# EAGLE schematic FLYTE 3.01 (EAGLE 9.6.2)
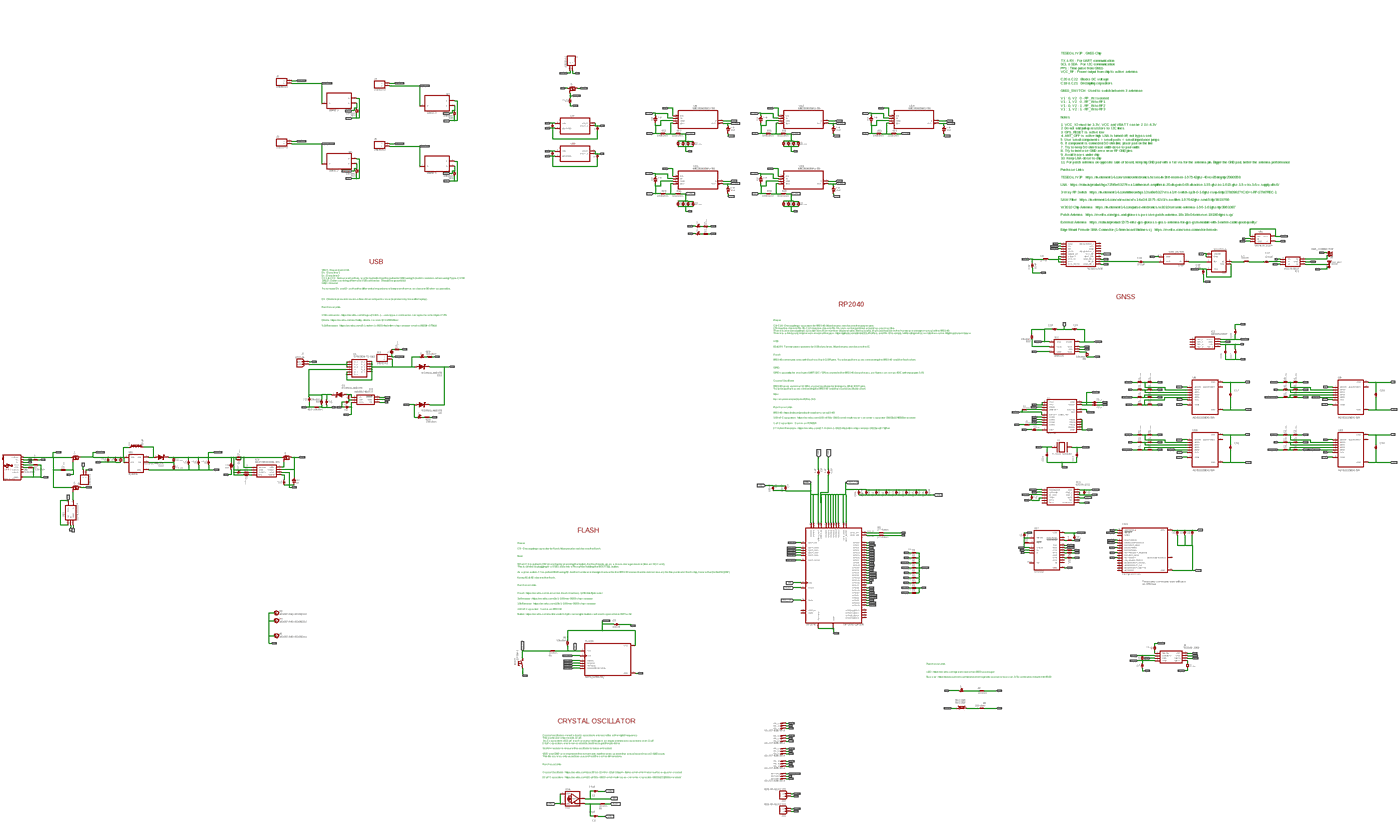
[diagram p0: schematic, sheet 1, overview]
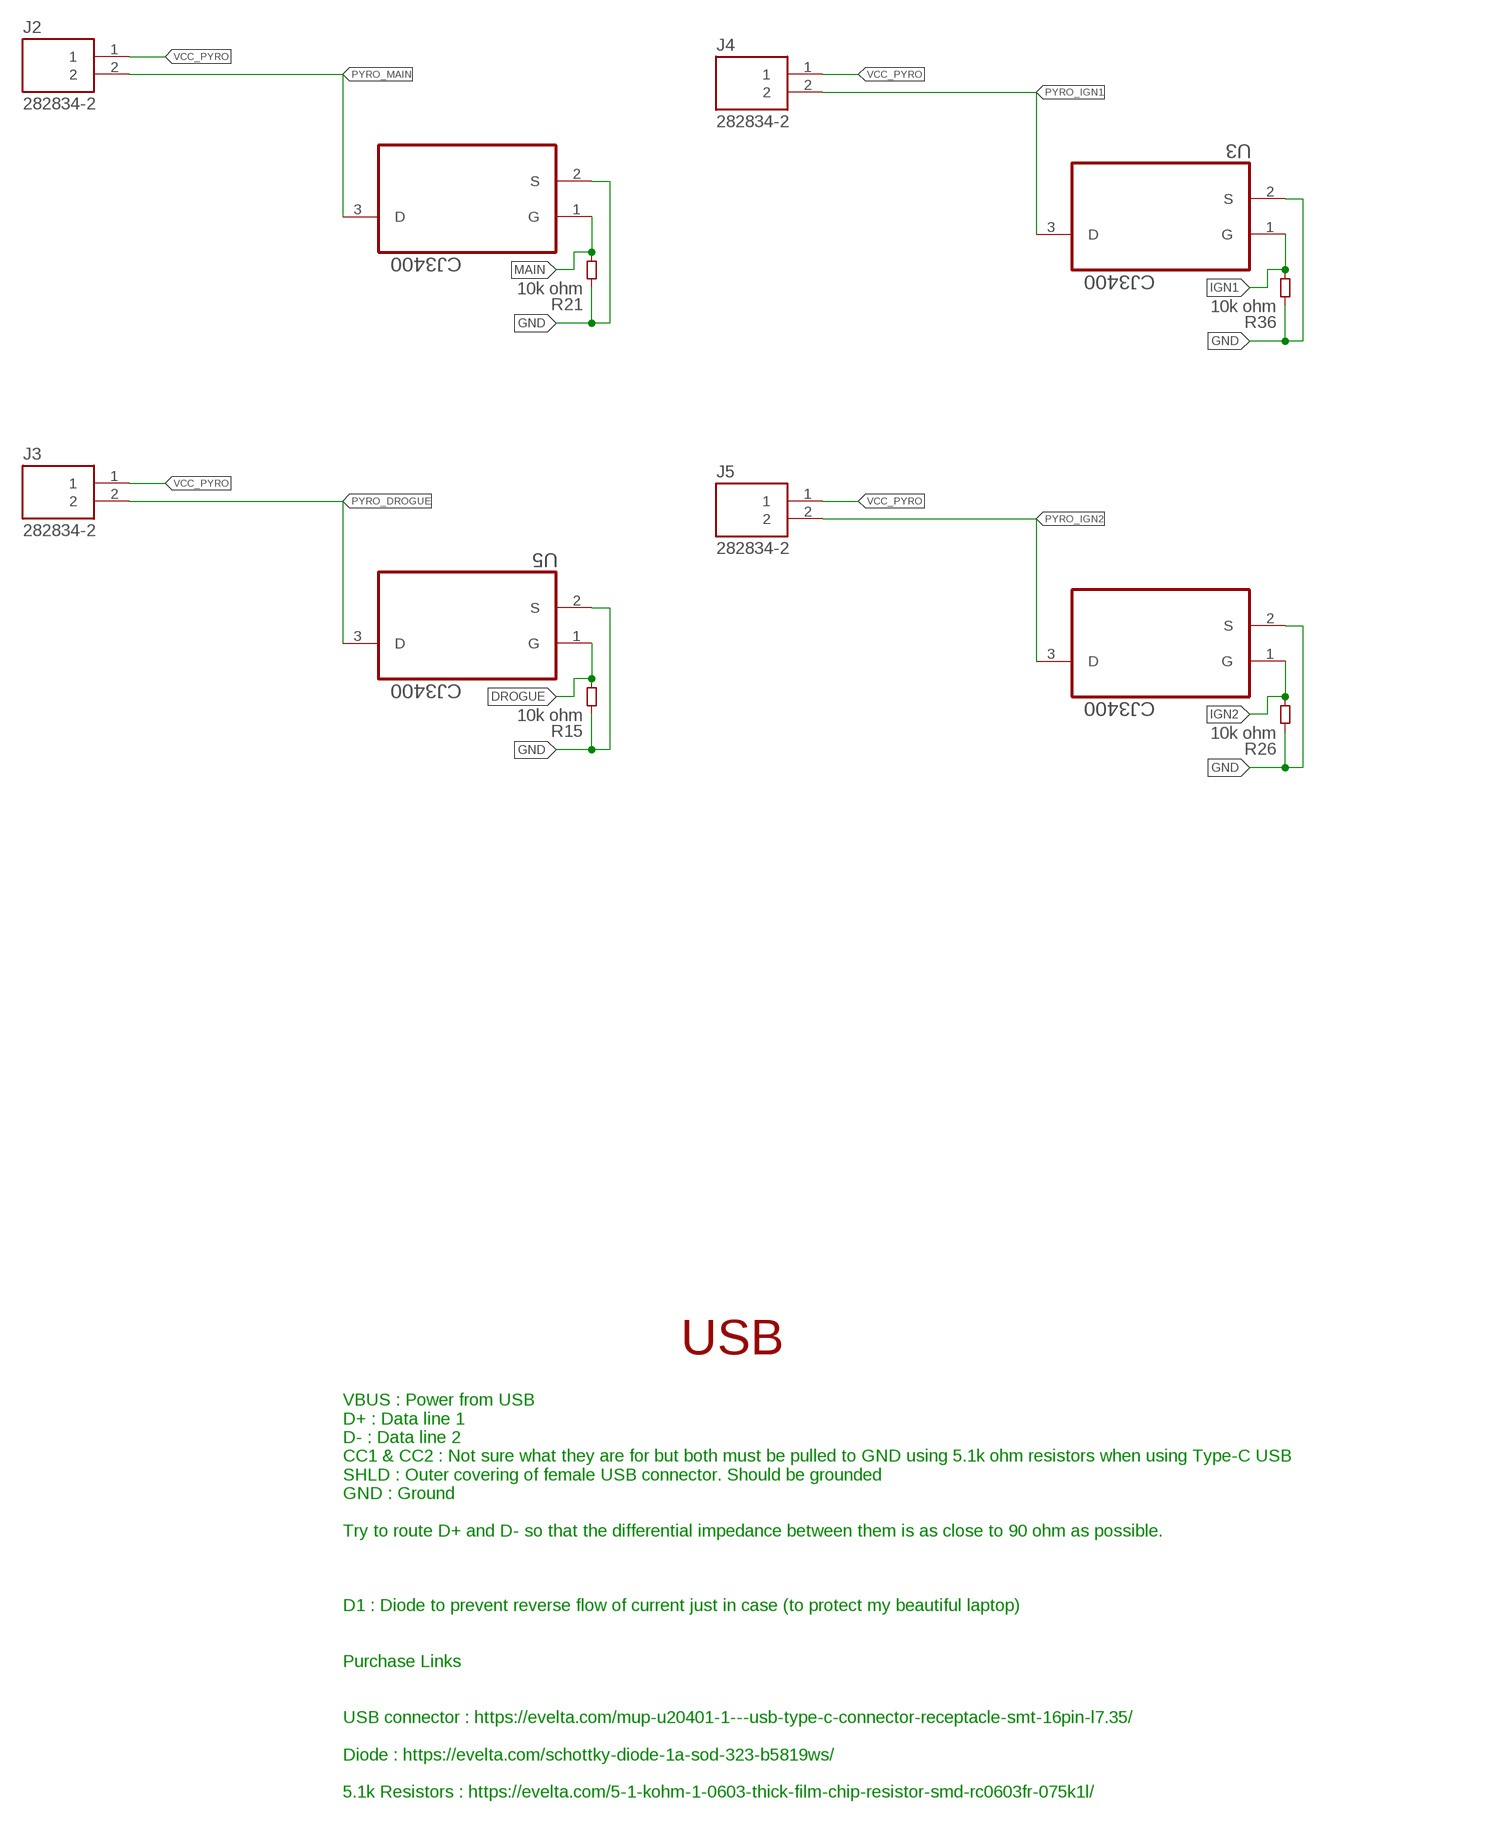
[diagram p1: schematic, sheet 1, part 1 of 6]
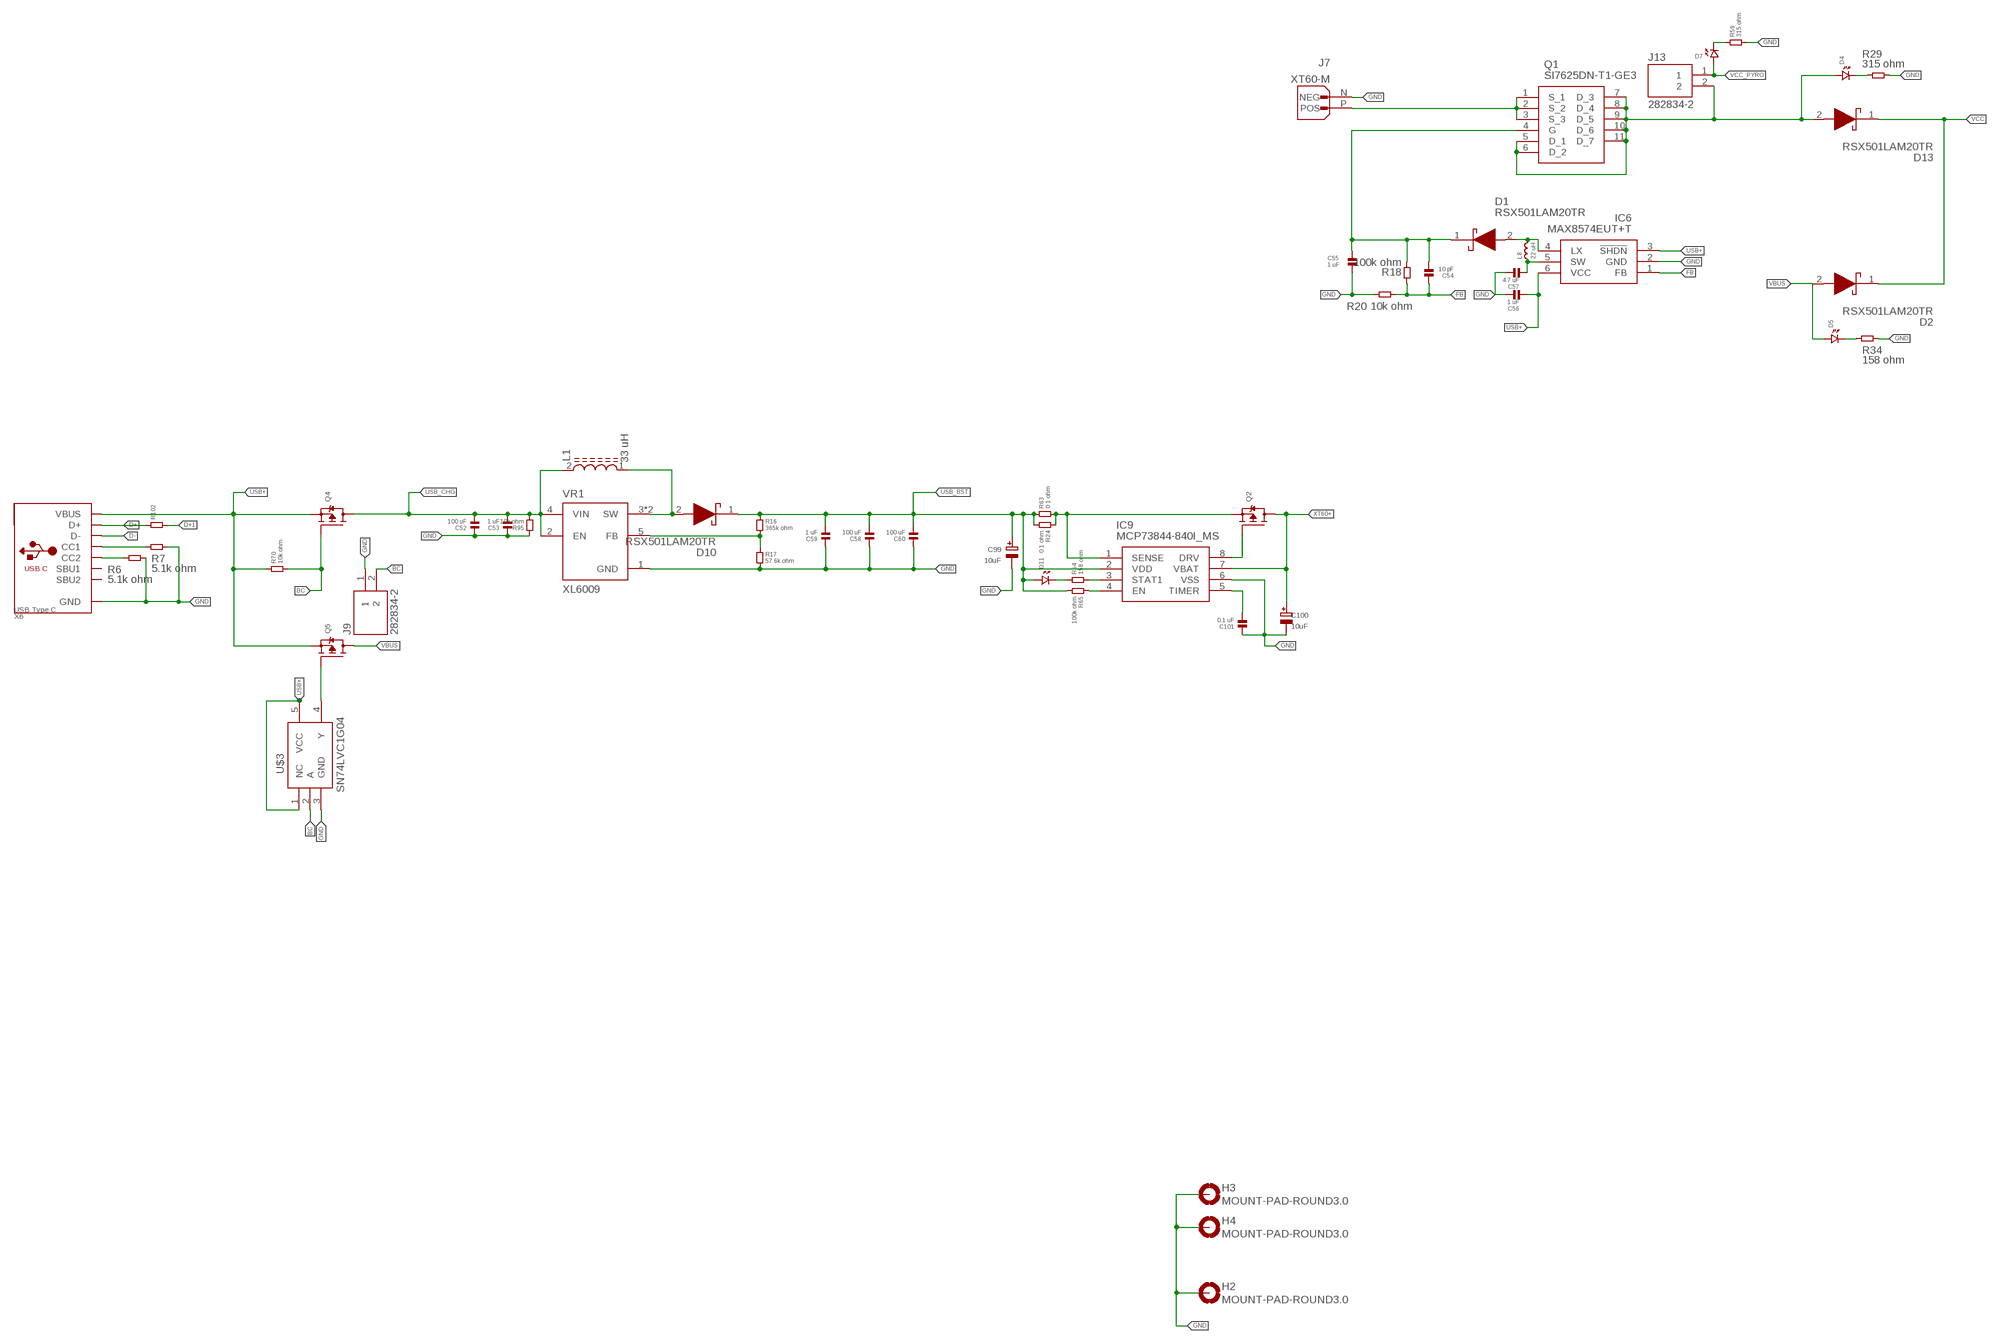
[diagram p2: schematic, sheet 1, part 2 of 6]
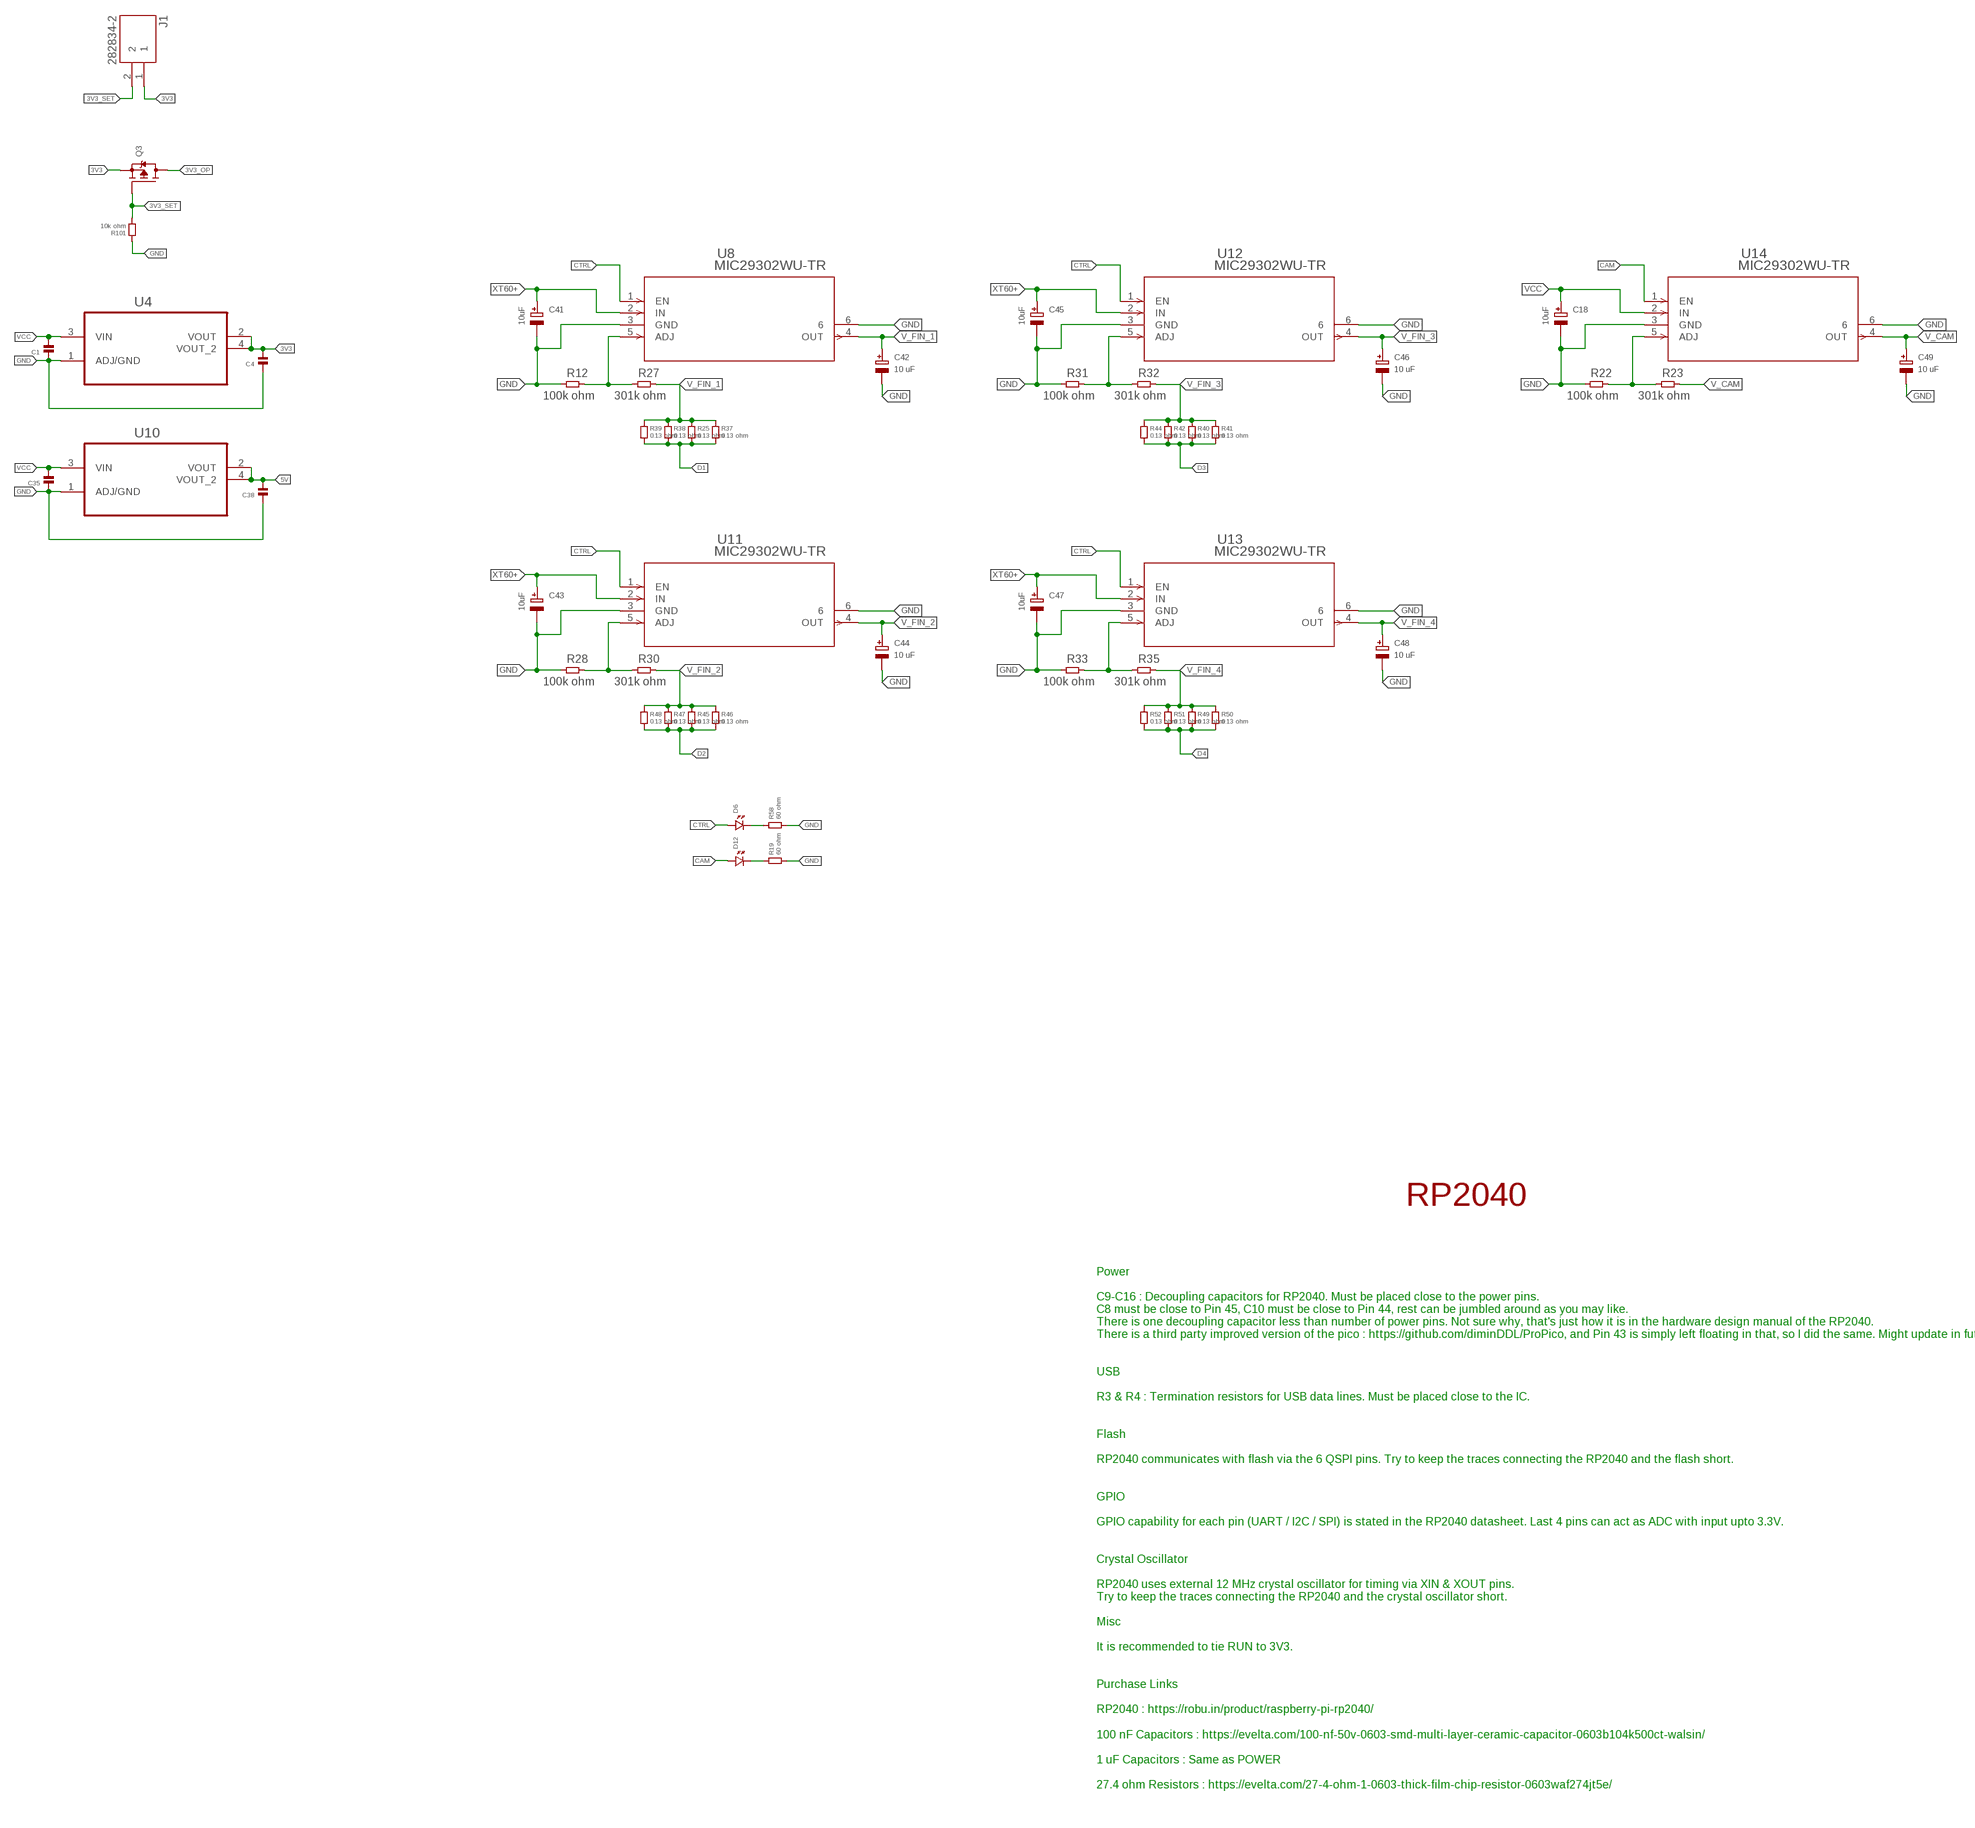
[diagram p3: schematic, sheet 1, part 3 of 6]
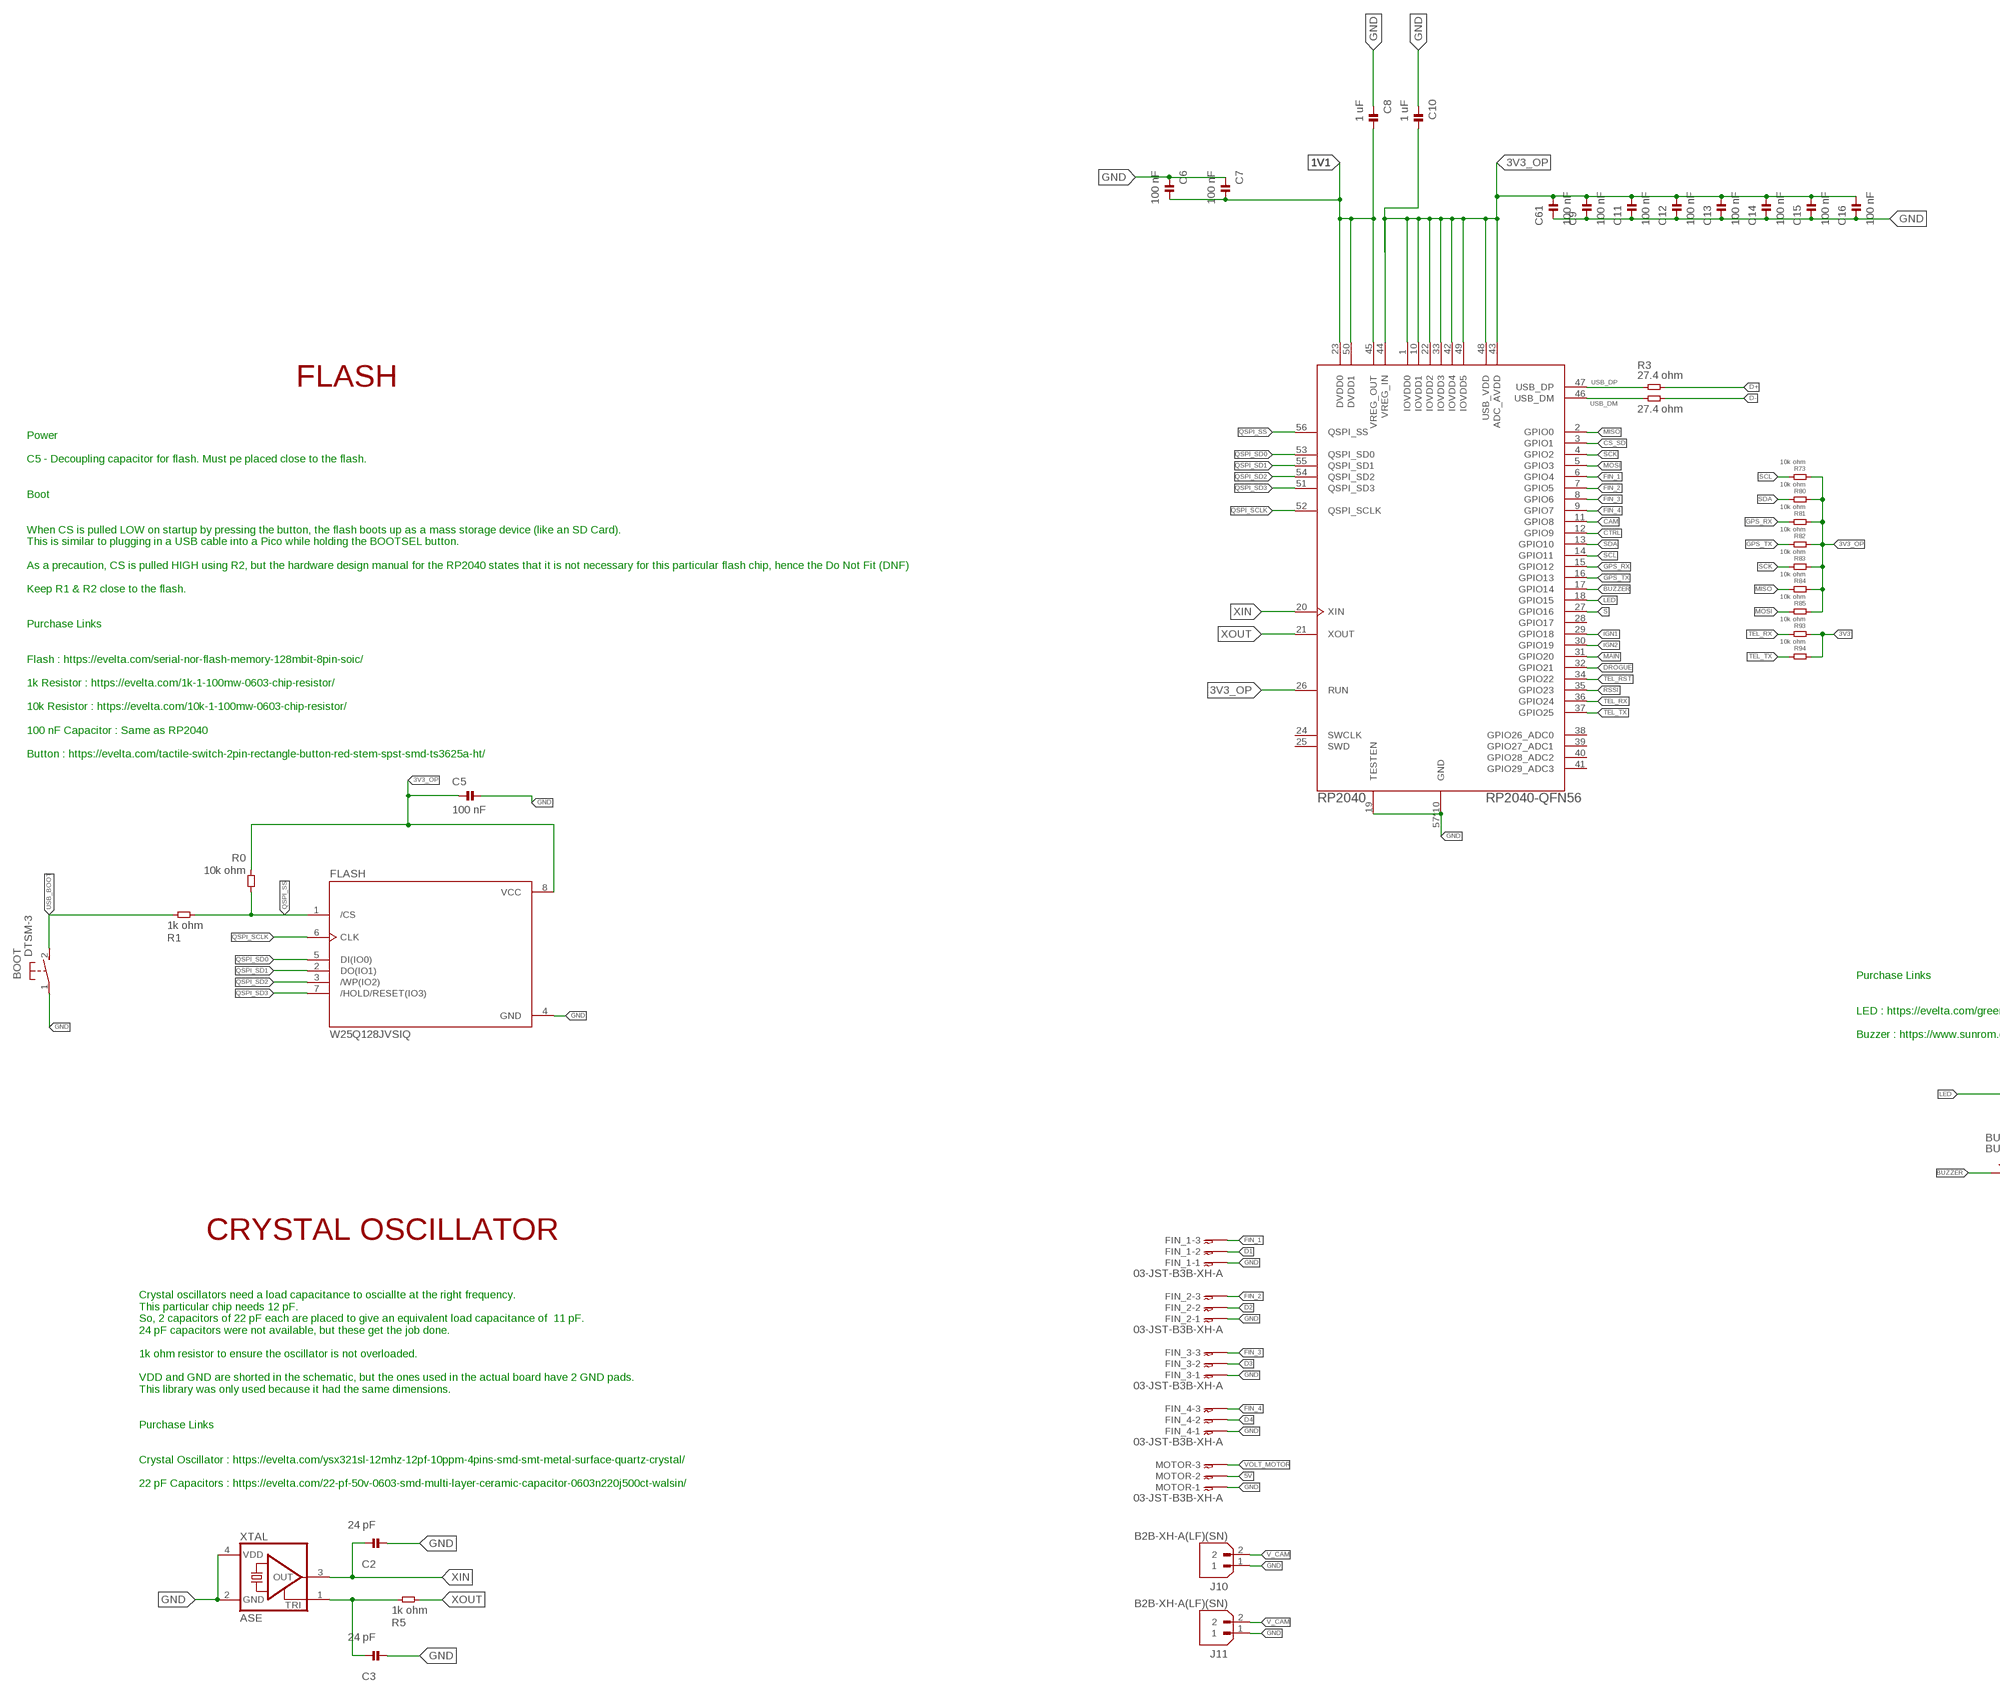
[diagram p4: schematic, sheet 1, part 4 of 6]
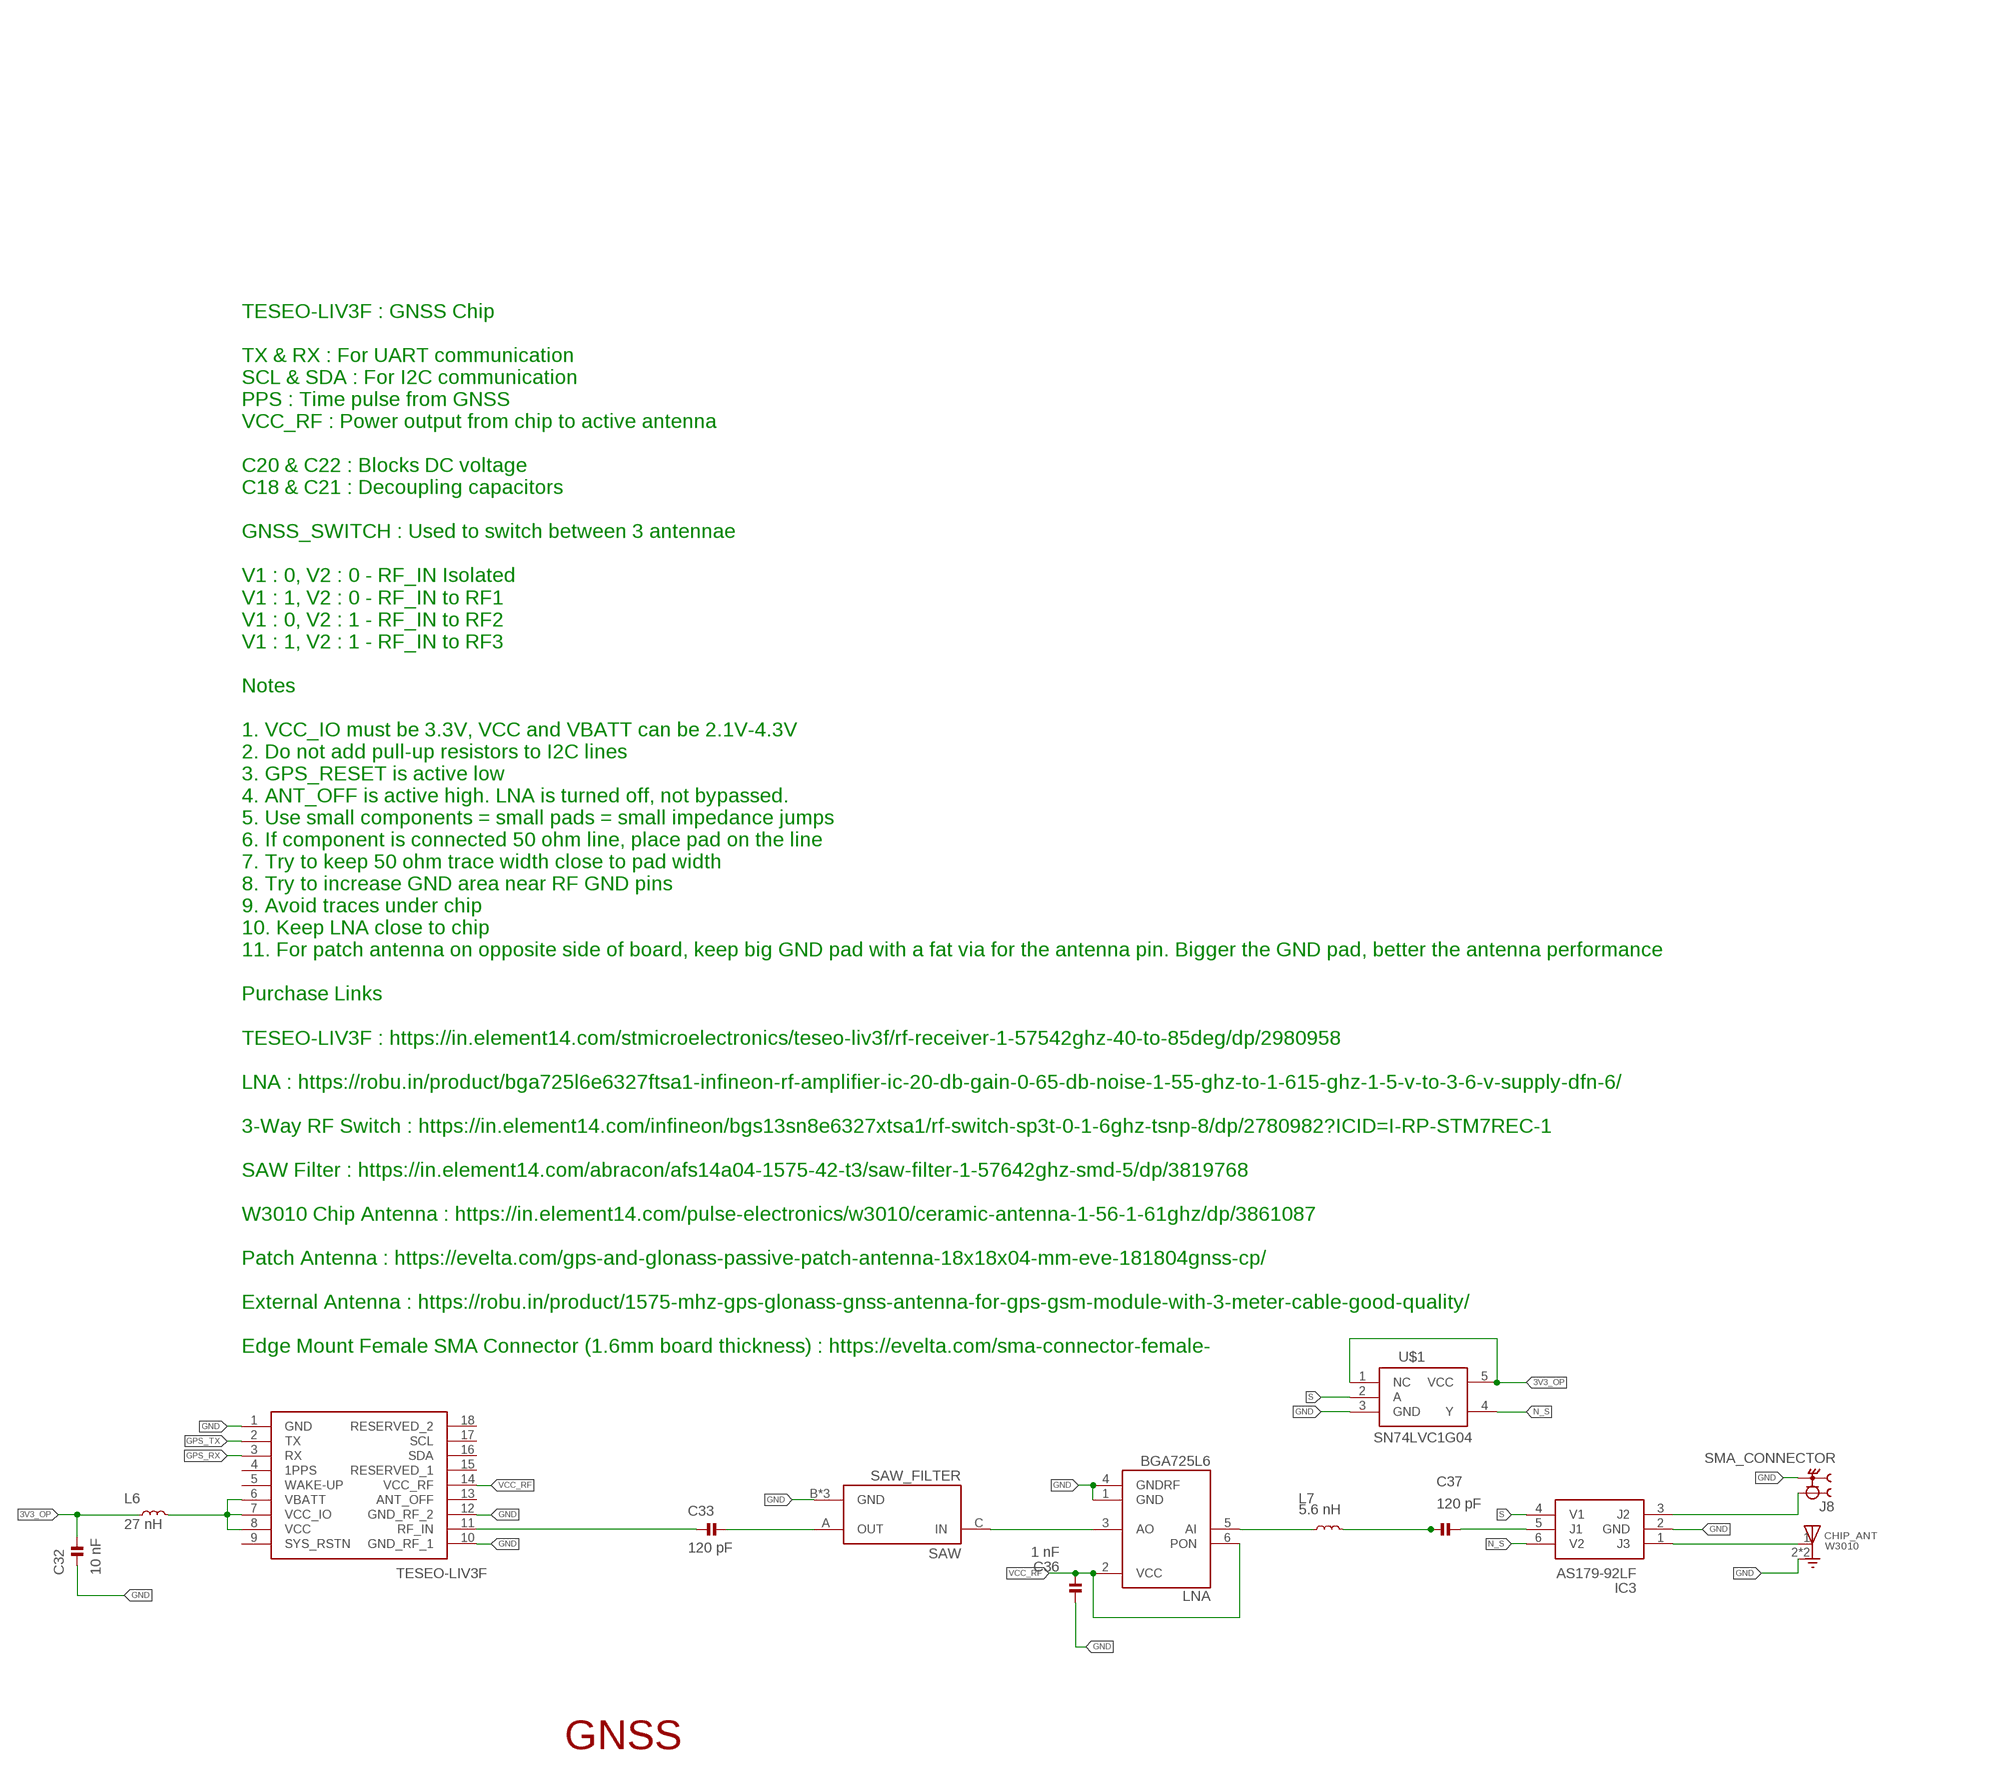
[diagram p5: schematic, sheet 1, part 5 of 6]
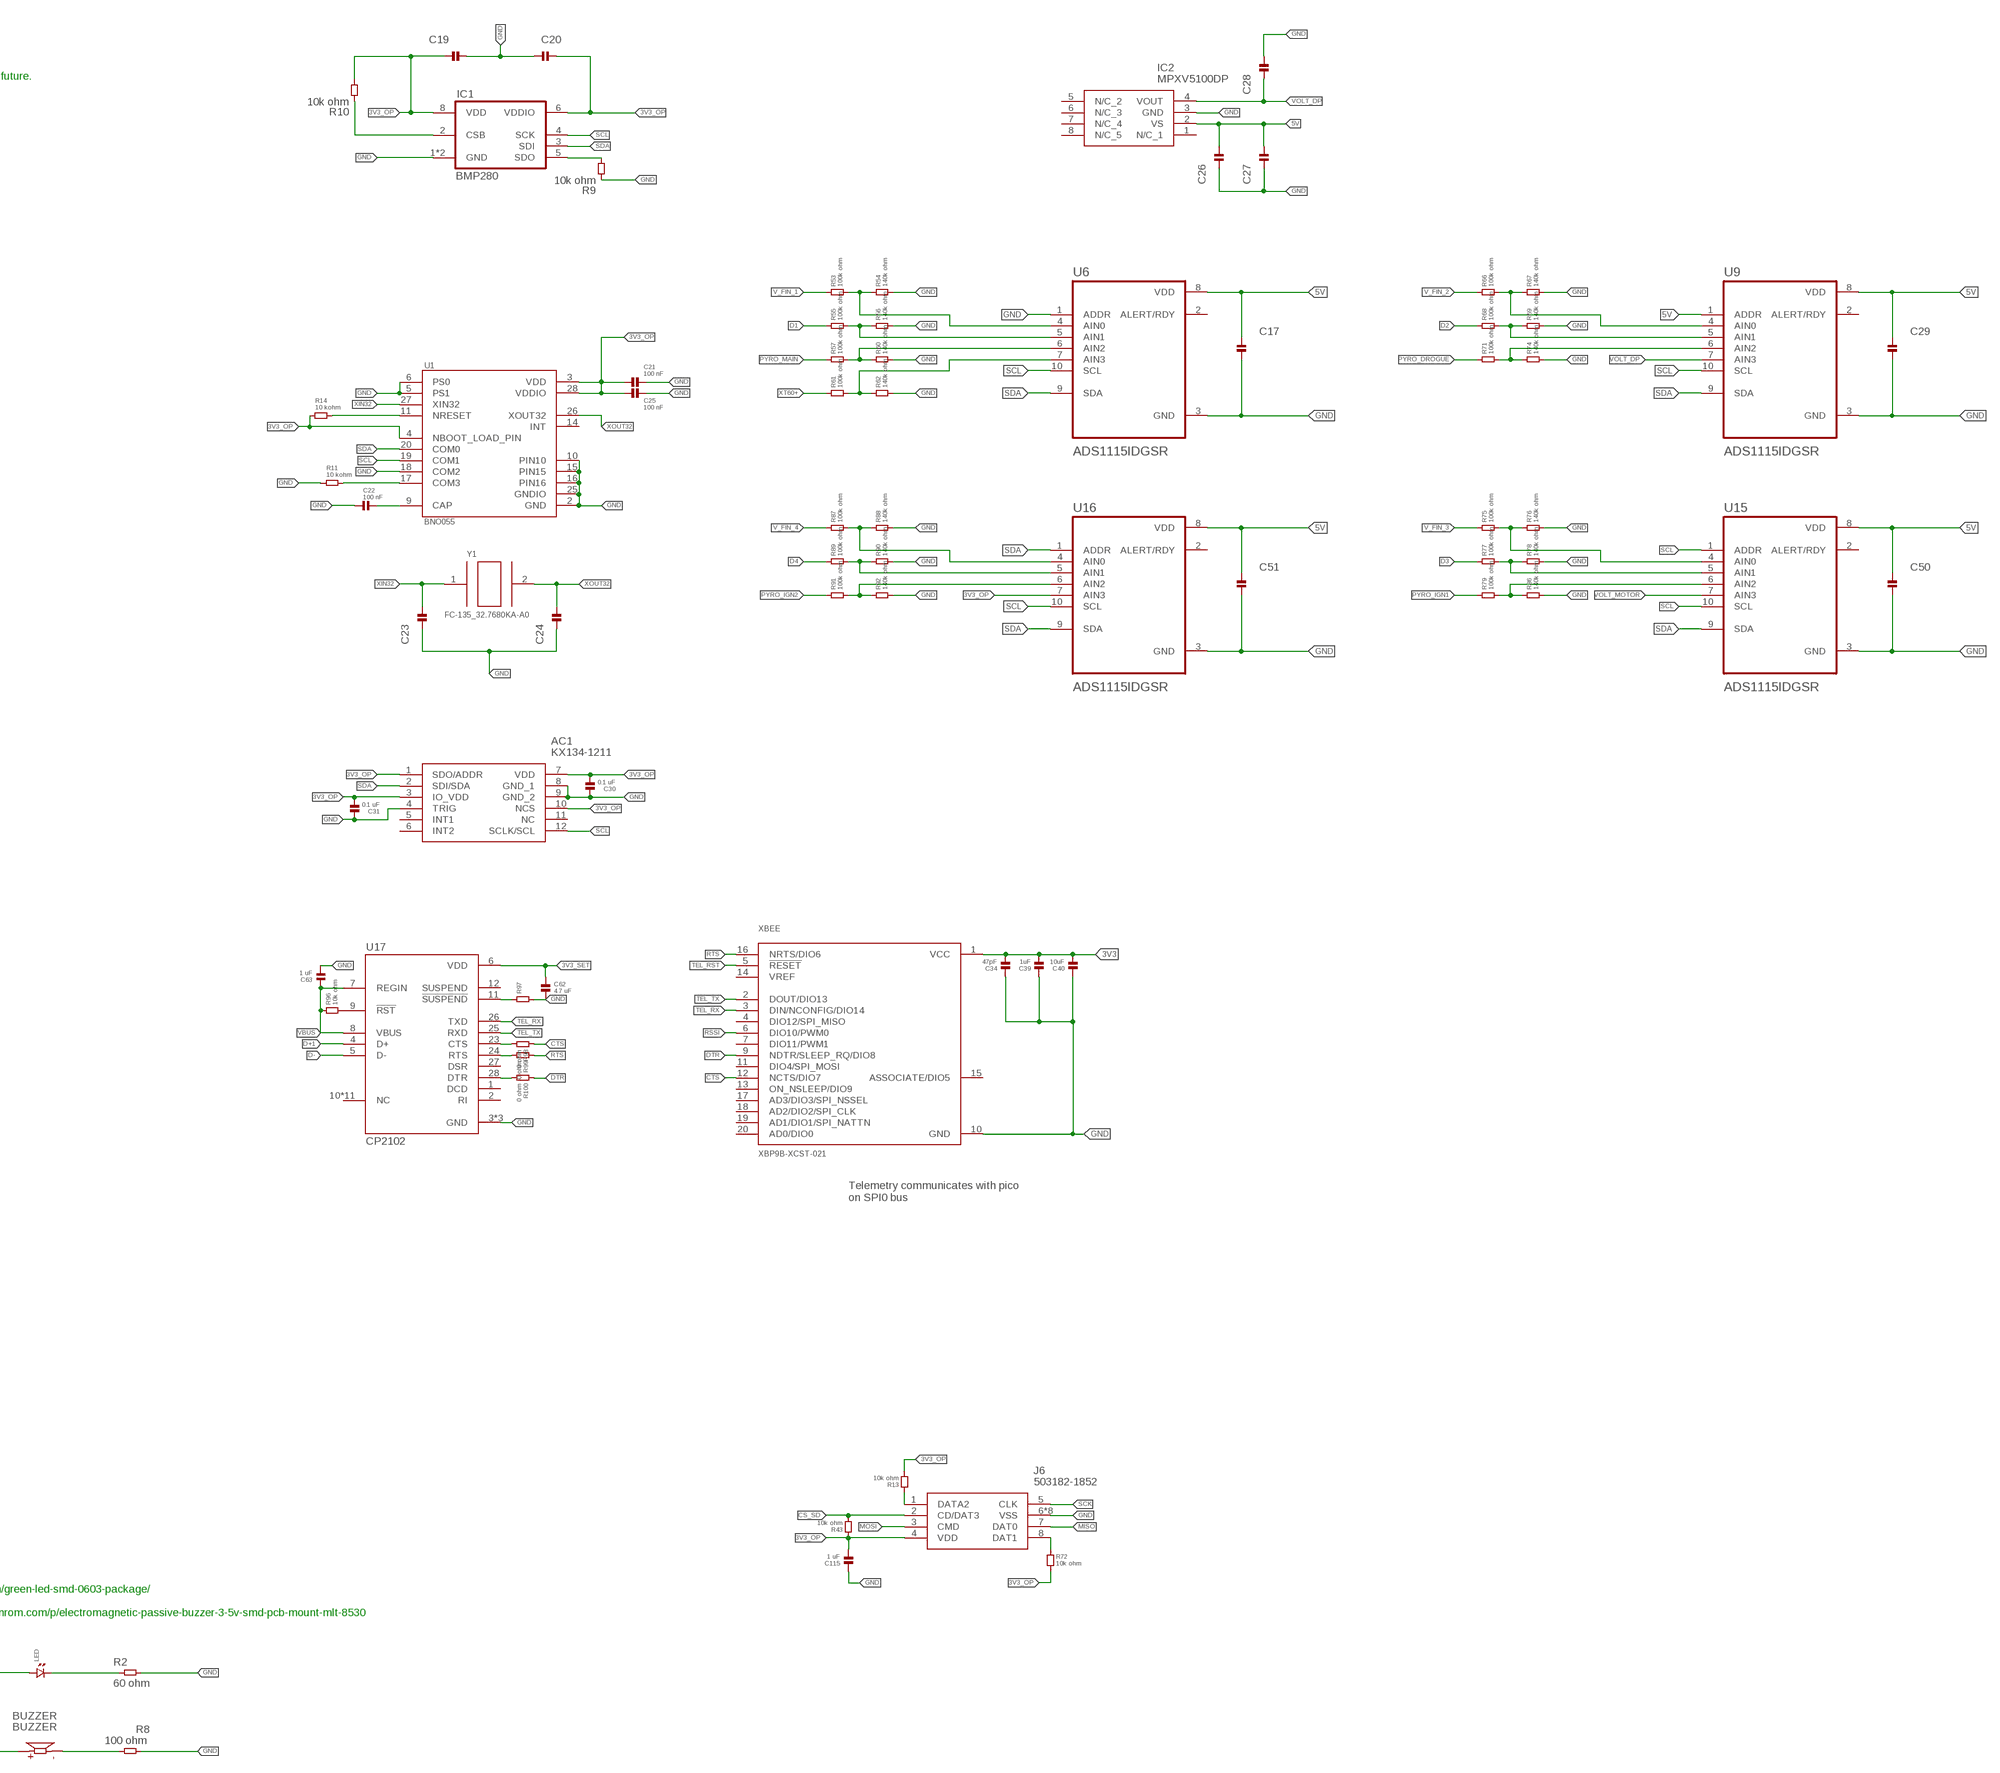
[diagram p6: schematic, sheet 1, part 6 of 6]

## Parts
AC1  KX134-1211  [KX1341211]
BOOT  DTSM-3  [DTSM-3]
BUZZER  BUZZER  CMT-8530S-SMT  [CUI_CMT-8530S-SMT]
C1  CAPACITOR.0603  [0603]
C2  24 pF  CAPACITOR.0603  [0603]
C3  24 pF  CAPACITOR.0603  [0603]
C4  CAPACITOR.0603  [0603]
C5  100 nF  CAPACITOR.0603  [0603]
C6  100 nF  CAPACITOR.0603  [0603]
C7  100 nF  CAPACITOR.0603  [0603]
C8  1 uF  CAPACITOR.0603  [0603]
C9  100 nF  CAPACITOR.0603  [0603]
C10  1 uF  CAPACITOR.0603  [0603]
C11  100 nF  CAPACITOR.0603  [0603]
C12  100 nF  CAPACITOR.0603  [0603]
C13  100 nF  CAPACITOR.0603  [0603]
C14  100 nF  CAPACITOR.0603  [0603]
C15  100 nF  CAPACITOR.0603  [0603]
C16  100 nF  CAPACITOR.0603  [0603]
C17  0.1 uF  CAPACITOR.0603  [0603]
C18  10uF  CAP_TANTALUMA/3216_WAVE  [EIA3216-18/A-W]
C19  100 nF  CAPACITOR.0603  [0603]
C20  100 nF  CAPACITOR.0603  [0603]
C21  100 nF  CAPACITOR.0603  [0603]
C22  100 nF  CAPACITOR.0603  [0603]
C23  25 pF  CAPACITOR.0603  [0603]
C24  25 pF  CAPACITOR.0603  [0603]
C25  100 nF  CAPACITOR.0603  [0603]
C26  1 uF  CAPACITOR.0603  [0603]
C27  10 nF  CAPACITOR.0603  [0603]
C28  470 pF  CAPACITOR.0603  [0603]
C29  0.1 uF  CAPACITOR.0603  [0603]
C30  0.1 uF  CAPACITOR.0603  [0603]
C31  0.1 uF  CAPACITOR.0603  [0603]
C32  10 nF  CAPACITOR.0603  [0603]
C33  120 pF  CAPACITOR.0603  [0603]
C34  47pF  CAPACITOR.0603  [0603]
C35  CAPACITOR.0603  [0603]
C36  1 nF  CAPACITOR.0603  [0603]
C37  120 pF  CAPACITOR.0603  [0603]
C38  CAPACITOR.0603  [0603]
C39  1uF  CAPACITOR.0603  [0603]
C40  10uF  CAPACITOR.0603  [0603]
C41  10uF  CAP_TANTALUMA/3216_WAVE  [EIA3216-18/A-W]
C42  10 uF  CAP_TANTALUMA/3216_WAVE  [EIA3216-18/A-W]
C43  10uF  CAP_TANTALUMA/3216_WAVE  [EIA3216-18/A-W]
C44  10 uF  CAP_TANTALUMA/3216_WAVE  [EIA3216-18/A-W]
C45  10uF  CAP_TANTALUMA/3216_WAVE  [EIA3216-18/A-W]
C46  10 uF  CAP_TANTALUMA/3216_WAVE  [EIA3216-18/A-W]
C47  10uF  CAP_TANTALUMA/3216_WAVE  [EIA3216-18/A-W]
C48  10 uF  CAP_TANTALUMA/3216_WAVE  [EIA3216-18/A-W]
C49  10 uF  CAP_TANTALUMA/3216_WAVE  [EIA3216-18/A-W]
C50  0.1 uF  CAPACITOR.0603  [0603]
C51  0.1 uF  CAPACITOR.0603  [0603]
C52  100 uF  CAPACITOR.1206  [1206]
C53  1 uF  CAPACITOR.0603  [0603]
C54  10 pF  CAPACITOR.0603  [0603]
C55  1 uF  CAPACITOR.0603  [0603]
C56  1 uF  CAPACITOR.0603  [0603]
C57  4.7 uF  CAPACITOR.0603  [0603]
C58  100 uF  CAPACITOR.1206  [1206]
C59  1 uF  CAPACITOR.0603  [0603]
C60  100 uF  CAPACITOR.1206  [1206]
C61  100 nF  CAPACITOR.0603  [0603]
C62  4.7 uF  CAPACITOR.0603  [0603]
C63  1 uF  CAPACITOR.0603  [0603]
C99  10uF  CAP_TANTALUMA/3216_WAVE  [EIA3216-18/A-W]
C100  10uF  CAP_TANTALUMA/3216_WAVE  [EIA3216-18/A-W]
C101  0.1 uF  CAPACITOR.0603  [0603]
C115  1 uF  CAPACITOR.0603  [0603]
CHIP_ANT  W3010  [XCVR_W3010]
D1  RSX501LAM20TR  [SODFL4725X105N]
D2  RSX501LAM20TR  [SODFL4725X105N]
D4  LED.0603  [0603.LED]
D5  LED.0603  [0603.LED]
D6  LED.0603  [0603.LED]
D7  LED.0603  [0603.LED]
D10  RSX501LAM20TR  [SODFL4725X105N]
D11  LED.0603  [0603.LED]
D12  LED.0603  [0603.LED]
D13  RSX501LAM20TR  [SODFL4725X105N]
FIN_1  03-JST-B3B-XH-A  [B3B-XH]
FIN_2  03-JST-B3B-XH-A  [B3B-XH]
FIN_3  03-JST-B3B-XH-A  [B3B-XH]
FIN_4  03-JST-B3B-XH-A  [B3B-XH]
FLASH  W25Q128JVSIQ  [SOIC127P790X216-8N]
GNSS  TESEO-LIV3F  [SON110P970X1010X230-18N]
H2  MOUNT-PAD-ROUND3.0  [3,0-PAD]
H3  MOUNT-PAD-ROUND3.0  [3,0-PAD]
H4  MOUNT-PAD-ROUND3.0  [3,0-PAD]
IC1  BMP280  [BMP280]
IC2  MPXV5100DP  [MPXV5100DP]
IC3  AS179-92LF  [SOT65P220X100-6N]
IC6  MAX8574EUT+T  [SOT95P280X145-6N]
IC9  MCP73844-840I_MS  MCP73843-420I_MS  [SOP65P490X110-8N]
J1  282834-2  [TE_282834-2]
J2  282834-2  [TE_282834-2]
J3  282834-2  [TE_282834-2]
J4  282834-2  [TE_282834-2]
J5  282834-2  [TE_282834-2]
J6  503182-1852  [5031821852]
J7  XT60-M  [AMASS_XT60-M]
J8  SMA_CONNECTOR  [LPRS_SMA_CONNECTOR]
J9  282834-2  [TE_282834-2]
J10  B2B-XH-A(LF)(SN)  [JST_B2B-XH-A(LF)(SN)]
J11  B2B-XH-A(LF)(SN)  [JST_B2B-XH-A(LF)(SN)]
J13  282834-2  [TE_282834-2]
L1  33 uH  SRR1260-330M  [INDP125125X600N]
L6  27 nH  RF-INDUCTOR.0603  [0603]
L7  5.6 nH  RF-INDUCTOR.0603  [0603]
L8  22 uH  RF-INDUCTOR.0603  [0603]
LED  LED.0603  [0603.LED]
LNA  BGA725L6  BGA725L6E6327FTSA1  [AMP_BGA725L6E6327FTSA1]
MOTOR  03-JST-B3B-XH-A  [B3B-XH]
Q1  SI7625DN-T1-GE3  [SIS862DNT1GE3]
Q2  MOSFET-PWIDE  [SOT23-WIDE]
Q3  MOSFET-PWIDE  [SOT23-WIDE]
Q4  MOSFET-PWIDE  [SOT23-WIDE]
Q5  MOSFET-PWIDE  [SOT23-WIDE]
R0  10k ohm  RESISTOR.0603  [0603]
R1  1k ohm  RESISTOR.0603  [0603]
R2  60 ohm  RESISTOR.0603  [0603]
R3  27.4 ohm  RESISTOR.0603  [0603]
R4  27.4 ohm  RESISTOR.0603  [0603]
R5  1k ohm  RESISTOR.0603  [0603]
R6  5.1k ohm  RESISTOR.0603  [0603]
R7  5.1k ohm  RESISTOR.0603  [0603]
R8  100 ohm  RESISTOR.0603  [0603]
R9  10k ohm  RESISTOR.0603  [0603]
R10  10k ohm  RESISTOR.0603  [0603]
R11  10 kohm  RESISTOR.0603  [0603]
R12  100k ohm  RESISTOR.0603  [0603]
R13  10k ohm  RESISTOR.0603  [0603]
R14  10 kohm  RESISTOR.0603  [0603]
R15  10k ohm  RESISTOR.0603  [0603]
R16  365k ohm  RESISTOR.0603  [0603]
R17  57.6k ohm  RESISTOR.0603  [0603]
R18  100k ohm  RESISTOR.0603  [0603]
R19  60 ohm  RESISTOR.0603  [0603]
R20  10k ohm  RESISTOR.0603  [0603]
R21  10k ohm  RESISTOR.0603  [0603]
R22  100k ohm  RESISTOR.0603  [0603]
R23  301k ohm  RESISTOR.0603  [0603]
R24  0.1 ohm  RESISTOR.0603  [0603]
R25  0.13 ohm  RESISTOR.0603  [0603]
R26  10k ohm  RESISTOR.0603  [0603]
R27  301k ohm  RESISTOR.0603  [0603]
R28  100k ohm  RESISTOR.0603  [0603]
R29  315 ohm  RESISTOR.0603  [0603]
R30  301k ohm  RESISTOR.0603  [0603]
R31  100k ohm  RESISTOR.0603  [0603]
R32  301k ohm  RESISTOR.0603  [0603]
R33  100k ohm  RESISTOR.0603  [0603]
R34  158 ohm  RESISTOR.0603  [0603]
R35  301k ohm  RESISTOR.0603  [0603]
R36  10k ohm  RESISTOR.0603  [0603]
R37  0.13 ohm  RESISTOR.0603  [0603]
R38  0.13 ohm  RESISTOR.0603  [0603]
R39  0.13 ohm  RESISTOR.0603  [0603]
R40  0.13 ohm  RESISTOR.0603  [0603]
R41  0.13 ohm  RESISTOR.0603  [0603]
R42  0.13 ohm  RESISTOR.0603  [0603]
R43  10k ohm  RESISTOR.0603  [0603]
R44  0.13 ohm  RESISTOR.0603  [0603]
R45  0.13 ohm  RESISTOR.0603  [0603]
R46  0.13 ohm  RESISTOR.0603  [0603]
R47  0.13 ohm  RESISTOR.0603  [0603]
R48  0.13 ohm  RESISTOR.0603  [0603]
R49  0.13 ohm  RESISTOR.0603  [0603]
R50  0.13 ohm  RESISTOR.0603  [0603]
R51  0.13 ohm  RESISTOR.0603  [0603]
R52  0.13 ohm  RESISTOR.0603  [0603]
R53  100k ohm  RESISTOR.0603  [0603]
R54  140k ohm  RESISTOR.0603  [0603]
R55  100k ohm  RESISTOR.0603  [0603]
R56  140k ohm  RESISTOR.0603  [0603]
R57  100k ohm  RESISTOR.0603  [0603]
R58  60 ohm  RESISTOR.0603  [0603]
R59  315 ohm  RESISTOR.0603  [0603]
R60  140k ohm  RESISTOR.0603  [0603]
R61  100k ohm  RESISTOR.0603  [0603]
R62  140k ohm  RESISTOR.0603  [0603]
R63  0.1 ohm  RESISTOR.0603  [0603]
R64  158 ohm  RESISTOR.0603  [0603]
R65  100k ohm  RESISTOR.0603  [0603]
R66  100k ohm  RESISTOR.0603  [0603]
R67  140k ohm  RESISTOR.0603  [0603]
R68  100k ohm  RESISTOR.0603  [0603]
R69  140k ohm  RESISTOR.0603  [0603]
R70  10k ohm  RESISTOR.0603  [0603]
R71  100k ohm  RESISTOR.0603  [0603]
R72  10k ohm  RESISTOR.0603  [0603]
R73  10k ohm  RESISTOR.0603  [0603]
R74  140k ohm  RESISTOR.0603  [0603]
R75  100k ohm  RESISTOR.0603  [0603]
R76  140k ohm  RESISTOR.0603  [0603]
R77  100k ohm  RESISTOR.0603  [0603]
R78  140k ohm  RESISTOR.0603  [0603]
R79  100k ohm  RESISTOR.0603  [0603]
R80  10k ohm  RESISTOR.0603  [0603]
R81  10k ohm  RESISTOR.0603  [0603]
R82  10k ohm  RESISTOR.0603  [0603]
R83  10k ohm  RESISTOR.0603  [0603]
R84  10k ohm  RESISTOR.0603  [0603]
R85  10k ohm  RESISTOR.0603  [0603]
R86  140k ohm  RESISTOR.0603  [0603]
R87  100k ohm  RESISTOR.0603  [0603]
R88  140k ohm  RESISTOR.0603  [0603]
R89  100k ohm  RESISTOR.0603  [0603]
R90  140k ohm  RESISTOR.0603  [0603]
R91  100k ohm  RESISTOR.0603  [0603]
R92  140k ohm  RESISTOR.0603  [0603]
R93  10k ohm  RESISTOR.0603  [0603]
R94  10k ohm  RESISTOR.0603  [0603]
R95  10k ohm  RESISTOR.0603  [0603]
R96  10k ohm  RESISTOR.0603  [0603]
R97  RESISTOR.0603  [0603]
R98  0 ohm  RESISTOR.0603  [0603]
R99  0 ohm  RESISTOR.0603  [0603]
R100  0 ohm  RESISTOR.0603  [0603]
R101  10k ohm  RESISTOR.0603  [0603]
R102  RESISTOR.0805  [0805]
RP2040  RP2040-QFN56  [RP2040-QFN-56]
SAW  SAW_FILTER  AFS14A04-1575.42-T3  [FIL_AFS14A04-1575.42-T3]
U1  BNO055  [LGA28R50P4X10_380X520X100]
U2  CJ3400  BS170F  [SOT91P240X120-3N]
U3  CJ3400  BS170F  [SOT91P240X120-3N]
U4  LM1117-3.3  [SOT230]
U5  CJ3400  BS170F  [SOT91P240X120-3N]
U6  ADS1115IDGSR  [SOP50P490X110-10N]
U7  CJ3400  BS170F  [SOT91P240X120-3N]
U8  MIC29302WU-TR  [TO-263-5_MCH]
U9  ADS1115IDGSR  [SOP50P490X110-10N]
U10  LM1117-3.3  [SOT230]
U11  MIC29302WU-TR  [TO-263-5_MCH]
U12  MIC29302WU-TR  [TO-263-5_MCH]
U13  MIC29302WU-TR  [TO-263-5_MCH]
U14  MIC29302WU-TR  [TO-263-5_MCH]
U15  ADS1115IDGSR  [SOP50P490X110-10N]
U16  ADS1115IDGSR  [SOP50P490X110-10N]
U17  CP2102  [QFN50P500X500X100-29N]
U$1  SN74LVC1G04DBVR  [SOT23-5]
U$3  SN74LVC1G04DBVR  [SOT23-5]
VR1  XL6009  [DPAK170P1435X465-6N]
X6  USB Type C  USB_C  [USB_C_CUSB31-CFM2AX-01-X]
XBEE  XBP9B-XCST-021  [DIP2200W51P200L3294H279Q20P]
XTAL  ASE  [ASE]
Y1  FC-135_32.7680KA-A0  [XTAL_FC-135_32.7680KA-A0]

## Nets
1V1: C6.2 C7.2 C8.2 RP2040.23(DVDD0) RP2040.45(VREG_OUT) RP2040.50(DVDD1)
3V3: C4.2 C34.2 C39.2 C40.2 J1.1 Q3.2(S) R93.2 R94.2 U4.2(VOUT) U4.4(VOUT_2) XBEE.1(VCC)
3V3_OP: AC1.1(SDO/ADDR) AC1.3(IO_VDD) AC1.7(VDD) AC1.10(NCS) C5.1 C9.2 C10.2 C11.2 C12.2 C13.2 C14.2 C15.2 C16.2 C19.2 C20.1 C21.1 C25.1 C30.2 C31.2 C32.2 C61.2 C115.2 FLASH.8(VCC) IC1.6(VDDIO) IC1.8(VDD) J6.4(VDD) L6.1 Q3.3(D) R0.2 R10.2 R13.2 R14.1 R43.1 R72.2 R73.2 R80.2 R81.2 R82.2 R83.2 R84.2 R85.2 RP2040.1(IOVDD0) RP2040.10(IOVDD1) RP2040.22(IOVDD2) RP2040.26(RUN) RP2040.33(IOVDD3) RP2040.42(IOVDD4) RP2040.43(ADC_AVDD) RP2040.44(VREG_IN) RP2040.48(USB_VDD) RP2040.49(IOVDD5) U1.3(VDD) U1.4(NBOOT_LOAD_PIN) U1.28(VDDIO) U16.7(AIN3) U$1.1(NC) U$1.5(VCC)
3V3_SET: C62.1 J1.2 Q3.1(G) R101.2 U17.6(VDD)
5V: C17.1 C26.1 C27.1 C29.1 C38.2 C50.1 C51.1 IC2.2(VS) MOTOR.P$2 U6.8(VDD) U9.1(ADDR) U9.8(VDD) U10.2(VOUT) U10.4(VOUT_2) U15.8(VDD) U16.8(VDD)
BC: J9.2 Q4.1(G) R70.2 U$3.2(A)
BUZZER: BUZZER.P RP2040.17(GPIO14)
CAM: D12.P$1 RP2040.11(GPIO8) U14.1(EN)
CC1: R7.1 X6.A5(CC1)
CC2: R6.1 X6.B5(CC2)
CS_SD: J6.2(CD/DAT3) R43.2 RP2040.3(GPIO1)
CSB: IC1.2(CSB) R10.1
CTRL: D6.P$1 RP2040.12(GPIO9) U8.1(EN) U11.1(EN) U12.1(EN) U13.1(EN)
CTS: R98.1 XBEE.12(NCTS/DIO7)
D1: FIN_1.P$2 R25.2 R37.2 R38.2 R39.2 R55.1
D2: FIN_2.P$2 R45.2 R46.2 R47.2 R48.2 R68.1
D3: FIN_3.P$2 R40.2 R41.2 R42.2 R44.2 R77.1
D4: FIN_4.P$2 R49.2 R50.2 R51.2 R52.2 R89.1
D+: R3.2 R102.1 X6.A6(D+) X6.B6(D+)
D+1: R102.2 U17.4(D+)
D-: R4.2 U17.5(D-) X6.A7(D-) X6.B7(D-)
DROGUE: R15.2 RP2040.32(GPIO21) U5.1(G)
DTR: R100.1 XBEE.9(NDTR/SLEEP_RQ/DIO8)
FB: C54.1 IC6.1(FB) R18.1 R20.1
FIN_1: FIN_1.P$3 RP2040.6(GPIO4)
FIN_2: FIN_2.P$3 RP2040.7(GPIO5)
FIN_3: FIN_3.P$3 RP2040.8(GPIO6)
FIN_4: FIN_4.P$3 RP2040.9(GPIO7)
GND: AC1.4(TRIG) AC1.8(GND_1) AC1.9(GND_2) BOOT.1 C1.1 C2.1 C3.1 C4.1 C5.2 C6.1 C7.1 C8.1 C9.1 C10.1 C11.1 C12.1 C13.1 C14.1 C15.1 C16.1 C17.2 C18.- C19.1 C20.2 C21.2 C22.1 C23.2 C24.2 C25.2 C26.2 C27.2 C28.1 C29.2 C30.1 C31.1 C32.1 C34.1 C35.1 C36.1 C38.1 C39.1 C40.1 C41.- C42.- C43.- C44.- C45.- C46.- C47.- C48.- C49.- C50.2 C51.2 C52.1 C53.1 C55.2 C56.2 C57.2 C58.1 C59.1 C60.1 C61.1 C62.2 C63.2 C99.- C100.- C101.1 C115.1 CHIP_ANT.2(GND) CHIP_ANT.3(GND) FIN_1.P$1 FIN_2.P$1 FIN_3.P$1 FIN_4.P$1 FLASH.4(GND) GNSS.1(GND) GNSS.10(GND_RF_1) GNSS.12(GND_RF_2) H2.B3,0(MOUNT) H3.B3,0(MOUNT) H4.B3,0(MOUNT) IC1.1(GND) IC1.7(GND) IC2.3(GND) IC3.2(GND) IC6.2(GND) IC9.6(VSS) J6.6(VSS) J6.9(VSS) J6.10(VSS) J6.11(VSS) J6.12(VSS) J6.13(VSS) J6.14(VSS) J6.15(VSS) J7.N(NEG) J8.G1 J8.G2 J8.G3 J8.G4 J9.1 J10.1 J11.1 LNA.1(GND) LNA.4(GNDRF) MOTOR.P$1 R2.2 R6.2 R7.2 R8.2 R9.1 R11.1 R12.2 R15.1 R17.2 R19.2 R20.2 R21.1 R22.2 R26.1 R28.2 R29.1 R31.2 R33.2 R34.1 R36.1 R54.2 R56.2 R58.2 R59.2 R60.2 R62.2 R67.2 R69.2 R74.2 R76.2 R78.2 R86.2 R88.2 R90.2 R92.2 R95.1 R97.2 R101.1 RP2040.19(TESTEN) RP2040.57(GND) RP2040.58(GND) RP2040.59(GND) RP2040.60(GND) RP2040.61(GND) RP2040.62(GND) RP2040.63(GND) RP2040.64(GND) RP2040.65(GND) RP2040.66(GND) SAW.B(GND) SAW.D(GND) SAW.E(GND) U1.2(GND) U1.5(PS1) U1.6(PS0) U1.10(PIN10) U1.15(PIN15) U1.16(PIN16) U1.18(COM2) U1.25(GNDIO) U2.2(S) U3.2(S) U4.1(ADJ/GND) U5.2(S) U6.1(ADDR) U6.3(GND) U7.2(S) U8.3(GND) U8.6 U9.3(GND) U10.1(ADJ/GND) U11.3(GND) U11.6 U12.3(GND) U12.6 U13.3(GND) U13.6 U14.3(GND) U14.6 U15.3(GND) U16.3(GND) U17.3(GND) U17.29(GND) U17.P$1(GND) U$1.3(GND) U$3.3(GND) VR1.1(GND) X6.A1B12(GND) X6.B1A12(GND) XBEE.10(GND) XTAL.2(GND) XTAL.4(VDD)
GPS_RX: GNSS.3(RX) R81.1 RP2040.15(GPIO12)
GPS_TX: GNSS.2(TX) R82.1 RP2040.16(GPIO13)
IGN1: R36.2 RP2040.29(GPIO18) U3.1(G)
IGN2: R26.2 RP2040.30(GPIO19) U2.1(G)
LED: LED.P$1 RP2040.18(GPIO15)
MAIN: R21.2 RP2040.31(GPIO20) U7.1(G)
MISO: J6.7(DAT0) R84.1 RP2040.2(GPIO0)
MOS: D4.P$1 D13.2(A) J13.2 Q1.5(D_1) Q1.6(D_2) Q1.7(D_3) Q1.8(D_4) Q1.9(D_5) Q1.10(D_6) Q1.11(D_7)
MOSI: J6.3(CMD) R85.1 RP2040.5(GPIO3)
N$1: D1.2(A) IC6.4(LX) L8.2
N$2: LED.P$2 R2.1
N$3: C3.2 R5.1 XTAL.1(TRI)
N$4: C33.1 GNSS.11(RF_IN)
N$5: R12.1 R27.2 U8.5(ADJ)
N$6: BUZZER.N R8.1
N$7: D12.P$2 R19.1
N$8: J6.1(DATA2) R13.1
N$9: GNSS.6(VBATT) GNSS.7(VCC_IO) GNSS.8(VCC) L6.2
N$10: C22.2 U1.9(CAP)
N$11: R11.2 U1.17(COM3)
N$12: J6.8(DAT1) R72.1
N$13: R28.1 R30.2 U11.5(ADJ)
N$14: R31.1 R32.2 U12.5(ADJ)
N$15: R14.2 U1.11(NRESET)
N$16: R22.1 R23.2 U14.5(ADJ)
N$17: R33.1 R35.2 U13.5(ADJ)
N$18: D10.2(A) L1.1 VR1.3(SW) VR1.6(SW)
N$19: R16.2 R17.1 VR1.5(FB)
N$20: R55.2 R56.1 U6.5(AIN1)
N$21: R53.2 R54.1 U6.4(AIN0)
N$22: L7.1 LNA.5(AI)
N$23: C37.1 L7.2
N$24: C33.2 SAW.A(OUT)
N$25: LNA.3(AO) SAW.C(IN)
N$26: C37.2 IC3.5(J1)
N$27: CHIP_ANT.1(FEEDING) IC3.1(J3)
N$28: IC3.3(J2) J8.1
N$29: R57.2 R60.1 U6.6(AIN2)
N$30: R61.2 R62.1 U6.7(AIN3)
N$31: R66.2 R67.1 U9.4(AIN0)
N$32: R68.2 R69.1 U9.5(AIN1)
N$33: R71.2 R74.1 U9.6(AIN2)
N$34: R75.2 R76.1 U15.4(AIN0)
N$35: R77.2 R78.1 U15.5(AIN1)
N$36: R79.2 R86.1 U15.6(AIN2)
N$37: R87.2 R88.1 U16.4(AIN0)
N$38: R89.2 R90.1 U16.5(AIN1)
N$39: R91.2 R92.1 U16.6(AIN2)
N$40: R96.2 U17.9(!RST)
N$41: R97.1 U17.11(!SUSPEND)
N$42: R98.2 U17.23(CTS)
N$43: R99.2 U17.24(RTS)
N$44: IC9.1(SENSE) Q2.2(S) R24.1 R63.2
N$45: R100.2 U17.28(DTR)
N$51: C57.1 IC6.5(SW) L8.1
N$53: C54.2 C55.1 D1.1(K) Q1.4(G) R18.2
N$54: D4.P$2 R29.2
N$55: D5.P$2 R34.2
N$97: D6.P$2 R58.1
N$98: D7.P$2 R59.1
N$105: D11.P$2 R64.1
N$107: IC9.3(STAT1) R64.2
N$108: IC9.4(EN) R65.1
N$109: IC9.8(DRV) Q2.1(G)
N$110: C101.2 IC9.5(TIMER)
N$121: Q5.1(G) U$3.4(Y)
N_S: IC3.6(V2) U$1.4(Y)
PYRO_DROGUE: J3.2 R71.1 U5.3(D)
PYRO_IGN1: J4.2 R79.1 U3.3(D)
PYRO_IGN2: J5.2 R91.1 U2.3(D)
PYRO_MAIN: J2.2 R57.1 U7.3(D)
QSPI_SCLK: FLASH.6(CLK) RP2040.52(QSPI_SCLK)
QSPI_SD0: FLASH.5(DI(IO0)) RP2040.53(QSPI_SD0)
QSPI_SD1: FLASH.2(DO(IO1)) RP2040.55(QSPI_SD1)
QSPI_SD2: FLASH.3(/WP(IO2)) RP2040.54(QSPI_SD2)
QSPI_SD3: FLASH.7(/HOLD/RESET(IO3)) RP2040.51(QSPI_SD3)
QSPI_SS: FLASH.1(/CS) R0.1 R1.2 RP2040.56(QSPI_SS)
RSSI: RP2040.35(GPIO23) XBEE.6(DIO10/PWM0)
RTS: R99.1 XBEE.16(NRTS/DIO6)
S: IC3.4(V1) RP2040.27(GPIO16) U$1.2(A)
SCK: J6.5(CLK) R83.1 RP2040.4(GPIO2)
SCL: AC1.12(SCLK/SCL) IC1.4(SCK) R73.1 RP2040.14(GPIO11) U1.19(COM1) U6.10(SCL) U9.10(SCL) U15.1(ADDR) U15.10(SCL) U16.10(SCL)
SDA: AC1.2(SDI/SDA) IC1.3(SDI) R80.1 RP2040.13(GPIO10) U1.20(COM0) U6.9(SDA) U9.9(SDA) U15.9(SDA) U16.1(ADDR) U16.9(SDA)
SDO: IC1.5(SDO) R9.2
TEL_RST: RP2040.34(GPIO22) XBEE.5(!RESET)
TEL_RX: R93.1 RP2040.36(GPIO24) U17.26(TXD) XBEE.3(DIN/NCONFIG/DIO14)
TEL_TX: R94.1 RP2040.37(GPIO25) U17.25(RXD) XBEE.2(DOUT/DIO13)
USB+: C56.1 IC6.3(!SHDN) IC6.6(VCC) Q4.2(S) Q5.2(S) R70.1 U$3.1(NC) U$3.5(VCC) X6.A4B9(VBUS) X6.B4A9(VBUS)
USB_BOOT: BOOT.2 R1.1
USB_BST: C58.2 C59.2 C60.2 C99.+ D10.1(K) D11.P$1 IC9.2(VDD) R16.1 R24.2 R63.1 R65.2
USB_CHG: C52.2 C53.2 L1.2 Q4.3(D) R95.2 VR1.2(EN) VR1.4(VIN)
USB_DM: R4.1 RP2040.46(USB_DM)
USB_DP: R3.1 RP2040.47(USB_DP)
V_CAM: C49.+ J10.2 J11.2 R23.1 U14.4(OUT)
V_FIN_1: C42.+ R25.1 R27.1 R37.1 R38.1 R39.1 R53.1 U8.4(OUT)
V_FIN_2: C44.+ R30.1 R45.1 R46.1 R47.1 R48.1 R66.1 U11.4(OUT)
V_FIN_3: C46.+ R32.1 R40.1 R41.1 R42.1 R44.1 R75.1 U12.4(OUT)
V_FIN_4: C48.+ R35.1 R49.1 R50.1 R51.1 R52.1 R87.1 U13.4(OUT)
VBUS: C63.1 D2.2(A) D5.P$1 Q5.3(D) R96.1 U17.7(REGIN) U17.8(VBUS)
VCC: C1.2 C18.+ C35.2 D2.1(K) D13.1(K) U4.3(VIN) U10.3(VIN) U14.2(IN)
VCC_PYRO: D7.P$1 J2.1 J3.1 J4.1 J5.1 J13.1
VCC_RF: C36.2 GNSS.14(VCC_RF) LNA.2(VCC) LNA.6(PON)
VOLT_DP: C28.2 IC2.4(VOUT) U9.7(AIN3)
VOLT_MOTOR: MOTOR.P$3 U15.7(AIN3)
XIN: C2.2 RP2040.20(XIN) XTAL.3(OUT)
XIN32: C23.1 U1.27(XIN32) Y1.1
XOUT: R5.2 RP2040.21(XOUT)
XOUT32: C24.1 U1.26(XOUT32) Y1.2
XT60+: C41.+ C43.+ C45.+ C47.+ C100.+ IC9.7(VBAT) J7.P(POS) Q1.1(S_1) Q1.2(S_2) Q1.3(S_3) Q2.3(D) R61.1 U8.2(IN) U11.2(IN) U12.2(IN) U13.2(IN)
Unconnected: AC1.5(INT1) AC1.6(INT2) AC1.11(NC) GNSS.4(1PPS) GNSS.5(WAKE-UP) GNSS.9(SYS_RSTN) GNSS.13(ANT_OFF) GNSS.15(RESERVED_1) GNSS.16(SDA) GNSS.17(SCL) GNSS.18(RESERVED_2) IC2.1(N/C_1) IC2.5(N/C_2) IC2.6(N/C_3) IC2.7(N/C_4) IC2.8(N/C_5) RP2040.24(SWCLK) RP2040.25(SWD) RP2040.28(GPIO17) RP2040.38(GPIO26_ADC0) RP2040.39(GPIO27_ADC1) RP2040.40(GPIO28_ADC2) RP2040.41(GPIO29_ADC3) U1.14(INT) U6.2(ALERT/RDY) U9.2(ALERT/RDY) U15.2(ALERT/RDY) U16.2(ALERT/RDY) U17.1(DCD) U17.2(RI) U17.10(NC) U17.12(SUSPEND) U17.13(NC) U17.14(NC) U17.15(NC) U17.16(NC) U17.17(NC) U17.18(NC) U17.19(NC) U17.20(NC) U17.21(NC) U17.22(NC) U17.27(DSR) X6.A8(SBU1) X6.B8(SBU2) XBEE.4(DIO12/SPI_MISO) XBEE.7(DIO11/PWM1) XBEE.11(DIO4/SPI_MOSI) XBEE.13(ON_NSLEEP/DIO9) XBEE.14(VREF) XBEE.15(ASSOCIATE/DIO5) XBEE.17(AD3/DIO3/SPI_NSSEL) XBEE.18(AD2/DIO2/SPI_CLK) XBEE.19(AD1/DIO1/SPI_NATTN) XBEE.20(AD0/DIO0)

## Notes on the sheet
- TESEO-LIV3F : GNSS Chip
  
  TX & RX : For UART communication
  SCL & SDA : For I2C communication
  PPS : Time pulse from GNSS
  VCC_RF : Power output from chip to active antenna
  
  C20 & C22 : Blocks DC voltage
  C18 & C21 : Decoupling capacitors
  
  GNSS_SWITCH : Used to switch between 3 antennae
  
  V1 : 0, V2 : 0 - RF_IN Isolated
  V1 : 1, V2 : 0 - RF_IN to RF1
  V1 : 0, V2 : 1 - RF_IN to RF2
  V1 : 1, V2 : 1 - RF_IN to RF3
  
  Notes
  
  1. VCC_IO must be 3.3V, VCC and VBATT can be 2.1V-4.3V
  2. Do not add pull-up resistors to I2C lines
  3. GPS_RESET is active low
  4. ANT_OFF is active high. LNA is turned off, not bypassed.
  5. Use small components = small pads = small impedance jumps
  6. If component is connected 50 ohm line, place pad on the line
  7. Try to keep 50 ohm trace width close to pad width
  8. Try to increase GND area near RF GND pins
  9. Avoid traces under chip
  10. Keep LNA close to chip
  11. For patch antenna on opposite side of board, keep big GND pad with a fat via for the antenna pin. Bigger the GND pad, better the antenna performance
  
  Purchase Links
  
  TESEO-LIV3F : https://in.element14.com/stmicroelectronics/teseo-liv3f/rf-receiver-1-57542ghz-40-to-85deg/dp/2980958
  
  LNA : https://robu.in/product/bga725l6e6327ftsa1-infineon-rf-amplifier-ic-20-db-gain-0-65-db-noise-1-55-ghz-to-1-615-ghz-1-5-v-to-3-6-v-supply-dfn-6/
  
  3-Way RF Switch : https://in.element14.com/infineon/bgs13sn8e6327xtsa1/rf-switch-sp3t-0-1-6ghz-tsnp-8/dp/2780982?ICID=I-RP-STM7REC-1
  
  SAW Filter : https://in.element14.com/abracon/afs14a04-1575-42-t3/saw-filter-1-57642ghz-smd-5/dp/3819768
  
  W3010 Chip Antenna : https://in.element14.com/pulse-electronics/w3010/ceramic-antenna-1-56-1-61ghz/dp/3861087
  
  Patch Antenna : https://evelta.com/gps-and-glonass-passive-patch-antenna-18x18x04-mm-eve-181804gnss-cp/
  
  External Antenna : https://robu.in/product/1575-mhz-gps-glonass-gnss-antenna-for-gps-gsm-module-with-3-meter-cable-good-quality/
  
  Edge Mount Female SMA Connector (1.6mm board thickness) : https://evelta.com/sma-connector-female-pcb-edge-straight/
  
  10 nF Capacitor : https://evelta.com/10-nf-50v-0603-smd-multi-layer-ceramic-capacitor-0603b103k500ct-walsin/
  
  27 nH Inductor : https://evelta.com/27-nh-0603-surface-mount-high-frequency-inductor-vhf160808h27njt/
  
  10k ohm Resistor : https://evelta.com/10k-1-100mw-0603-chip-resistor/
  
  120 pF Capacitor : https://robu.in/product/mc0603n121j500ct-murata-smd-multilayer-ceramic-capacitor-120-pf-50-v-0603-1608-metric-±-5-c0g-np0-mc/
  
  1 nF Capacitor : https://evelta.com/1-nf-50v-0603-smd-multi-layer-ceramic-capacitor-0603b102k500ct-walsin/
  
  5.6 nH Inductor : https://evelta.com/5-6-nh-0603-surface-mount-high-frequency-inductor-vhf160808h5n6st/
- USB
- GNSS
- RP2040
- VBUS : Power from USB
  D+ : Data line 1
  D- : Data line 2
  CC1 & CC2 : Not sure what they are for but both must be pulled to GND using 5.1k ohm resistors when using Type-C USB
  SHLD : Outer covering of female USB connector. Should be grounded
  GND : Ground
  
  Try to route D+ and D- so that the differential impedance between them is as close to 90 ohm as possible.
  
  
  
  D1 : Diode to prevent reverse flow of current just in case (to protect my beautiful laptop)
  
  
  Purchase Links
  
  
  USB connector : https://evelta.com/mup-u20401-1---usb-type-c-connector-receptacle-smt-16pin-l7.35/
  
  Diode : https://evelta.com/schottky-diode-1a-sod-323-b5819ws/
  
  5.1k Resistors : https://evelta.com/5-1-kohm-1-0603-thick-film-chip-resistor-smd-rc0603fr-075k1l/
- Power
  
  C9-C16 : Decoupling capacitors for RP2040. Must be placed close to the power pins.
  C8 must be close to Pin 45, C10 must be close to Pin 44, rest can be jumbled around as you may like.
  There is one decoupling capacitor less than number of power pins. Not sure why, that's just how it is in the hardware design manual of the RP2040.
  There is a third party improved version of the pico : https://github.com/diminDDL/ProPico, and Pin 43 is simply left floating in that, so I did the same. Might update in future.
  
  
  USB
  
  R3 & R4 : Termination resistors for USB data lines. Must be placed close to the IC.
  
  
  Flash
  
  RP2040 communicates with flash via the 6 QSPI pins. Try to keep the traces connecting the RP2040 and the flash short.
  
  
  GPIO
  
  GPIO capability for each pin (UART / I2C / SPI) is stated in the RP2040 datasheet. Last 4 pins can act as ADC with input upto 3.3V.
  
  
  Crystal Oscillator
  
  RP2040 uses external 12 MHz crystal oscillator for timing via XIN & XOUT pins.
  Try to keep the traces connecting the RP2040 and the crystal oscillator short.
  
  Misc
  
  It is recommended to tie RUN to 3V3.
  
  
  Purchase Links
  
  RP2040 : https://robu.in/product/raspberry-pi-rp2040/
  
  100 nF Capacitors : https://evelta.com/100-nf-50v-0603-smd-multi-layer-ceramic-capacitor-0603b104k500ct-walsin/
  
  1 uF Capacitors : Same as POWER
  
  27.4 ohm Resistors : https://evelta.com/27-4-ohm-1-0603-thick-film-chip-resistor-0603waf274jt5e/
- FLASH
- Telemetry communicates with pico 
  on SPI0 bus
- Power
  
  C5 - Decoupling capacitor for flash. Must pe placed close to the flash.
  
  
  Boot
  
  
  When CS is pulled LOW on startup by pressing the button, the flash boots up as a mass storage device (like an SD Card). 
  This is similar to plugging in a USB cable into a Pico while holding the BOOTSEL button.
  
  As a precaution, CS is pulled HIGH using R2, but the hardware design manual for the RP2040 states that it is not necessary for this particular flash chip, hence the Do Not Fit (DNF)
  
  Keep R1 & R2 close to the flash.
  
  
  Purchase Links
  
  
  Flash : https://evelta.com/serial-nor-flash-memory-128mbit-8pin-soic/
  
  1k Resistor : https://evelta.com/1k-1-100mw-0603-chip-resistor/
  
  10k Resistor : https://evelta.com/10k-1-100mw-0603-chip-resistor/
  
  100 nF Capacitor : Same as RP2040
  
  Button : https://evelta.com/tactile-switch-2pin-rectangle-button-red-stem-spst-smd-ts3625a-ht/
- Purchase Links
  
  
  LED : https://evelta.com/green-led-smd-0603-package/
  
  Buzzer : https://www.sunrom.com/p/electromagnetic-passive-buzzer-3-5v-smd-pcb-mount-mlt-8530
- CRYSTAL OSCILLATOR
- Crystal oscillators need a load capacitance to osciallte at the right frequency.
  This particular chip needs 12 pF.
  So, 2 capacitors of 22 pF each are placed to give an equivalent load capacitance of  11 pF. 
  24 pF capacitors were not available, but these get the job done.
  
  1k ohm resistor to ensure the oscillator is not overloaded.
  
  VDD and GND are shorted in the schematic, but the ones used in the actual board have 2 GND pads.
  This library was only used because it had the same dimensions.
  
  
  Purchase Links
  
  
  Crystal Oscillator : https://evelta.com/ysx321sl-12mhz-12pf-10ppm-4pins-smd-smt-metal-surface-quartz-crystal/
  
  22 pF Capacitors : https://evelta.com/22-pf-50v-0603-smd-multi-layer-ceramic-capacitor-0603n220j500ct-walsin/

## Library data of the parts
AC1 = KX134-1211:KX134-1211: Accelerometers Tri-Axis Acclrmtr 8g, 16g, 32g Source: Datasheet <https://www.mouser.it/datasheet/2/348/KX134-1211-Specifications-Rev-1.0-1659717.pdf>; DESCRIPTION: Accelerometers Tri-Axis Acclrmtr 8g, 16g, 32g; HEIGHT: 1mm; MANUFACTURER_NAME: Kionix; MANUFACTURER_PART_NUMBER: KX134-1211
BOOT = switch-tact:DTSM-3
BUZZER = CMT-8530S-SMT:CMT-8530S-SMT: 8.5 mm, 3.6 Vo-p, 90 dB, Surface Mount (SMT), Magnetic Audio Transducer Buzzer Check availability <https://pricing.snapeda.com/parts/CMT-8530S-SMT-TR/CUI%20Devices/view-part?ref=eda>; AVAILABILITY: In Stock; CHECK_PRICES: https://www.snapeda.com/parts/CMT-8530S-SMT-TR/CUI+Devices/view-part/?ref=eda; CUI_PURCHASE_URL: https://www.cuidevices.com/product/audio/buzzers/audio-transducers/cmt-8530s-smt-tr?utm_source=snapeda.com&utm_medium=referral&utm_campaign=snapedaBOM; DESCRIPTION: 8.5 mm, 3.6 Vo-p, 90 dB, Surface Mount (SMT), Magnetic Audio Transducer Buzzer; MF: CUI Devices; MP: CMT-8530S-SMT-TR; PACKAGE: None; PRICE: None; PURCHASE-URL: https://www.snapeda.com/api/url_track_click_mouser/?unipart_id=649163&manufacturer=CUI Devices&part_name=CMT-8530S-SMT-TR&search_term=None; SNAPEDA_LINK: https://www.snapeda.com/parts/CMT-8530S-SMT-TR/CUI+Devices/view-part/?ref=snap
C1-C17 C19-C40 C50-C63 C101 C115 = standardparts:CAPACITOR
C18 C41-C49 C99 C100 = microbuilder:CAP_TANTALUM: Tantalum Capacitors Wave footprints have larger pads and are meant to be used for hand soldering. Reflow footprints are optimised for solder paste and a reflow oven. EIA3216-18/A-[R/W] - Size A / 3216-18 / 1206 footprint 4.7µF 25V 10% Tantalum Capacitor 10µF 16V 10% Tantalum Capacitor [Digikey: 495-2236-2-ND] EIA3528-21/B-[R/W] - Size B / 3528-21 47µF 10V 10% Tantalum Capactior [Digikey: 495-2216-1-ND] EIA6032-28/C-[R/W] - Size C / 6032-28 10µF 35V 20% Tantalum Capacitor [Digikey: 495-2285-1-ND] 100µF 16V 10% Tantalum Capactior [Digikey: 399-5214-1-ND]
CHIP_ANT = W3010:W3010: 1.575GHz GPS Chip RF Antenna 2.8dBi Solder Surface Mount Check availability <https://pricing.snapeda.com/parts/W3010/PulseLarsen%20Antennas/view-part?ref=eda>; AVAILABILITY: Not in stock; CHECK_PRICES: https://www.snapeda.com/parts/W3010/PulseLarsen+Antennas/view-part/?ref=eda; DESCRIPTION: 1.575GHz GPS Chip RF Antenna - 2.8dBi Solder Surface Mount; MF: PulseLarsen Antennas; MP: W3010; PACKAGE: None; PRICE: None; PURCHASE-URL: https://www.snapeda.com/api/url_track_click_mouser/?unipart_id=242644&manufacturer=PulseLarsen Antennas&part_name=W3010&search_term=None; SNAPEDA_LINK: https://www.snapeda.com/parts/W3010/PulseLarsen+Antennas/view-part/?ref=snap
D1 D2 D10 D13 = RSX501LAM20TR:RSX501LAM20TR: 20V, 5A, SOD-128, Schottky Barrier Diode Source: Datasheet <https://fscdn.rohm.com/en/products/databook/datasheet/discrete/diode/schottky_barrier/rsx501lam20tr-e.pdf>; DESCRIPTION: 20V, 5A, SOD-128, Schottky Barrier Diode; HEIGHT: 1.05mm; MANUFACTURER_NAME: ROHM Semiconductor; MANUFACTURER_PART_NUMBER: RSX501LAM20TR
D4-D7 D11 D12 LED = standardparts:LED
FIN_1-FIN_4 MOTOR = bt_con-jst-xh (1):03-JST: JST CONNECTOR
FLASH = W25Q128JVSIQ:W25Q128JVSIQ: Check availability <https://pricing.snapeda.com/parts/W25Q128JVSIQ/Winbond%20Electronics/view-part?ref=eda>; AVAILABILITY: In Stock; CHECK_PRICES: https://www.snapeda.com/parts/W25Q128JVSIQ/Winbond+Electronics/view-part/?ref=eda; DESCRIPTION: FLASH - NOR Memory IC 128Mb (16M x 8) SPI - Quad I/O, QPI, DTR 133 MHz 8-SOIC; MF: Winbond Electronics; MP: W25Q128JVSIQ; PACKAGE: SOIC-8 Winbond Electronics; PRICE: None; SNAPEDA_LINK: https://www.snapeda.com/parts/W25Q128JVSIQ/Winbond+Electronics/view-part/?ref=snap
GNSS = TESEO-LIV3F:TESEO-LIV3F: GPS Modules Tiny GNSS module Source: Datasheet <https://componentsearchengine.com/Datasheets/1/TESEO-LIV3F.pdf> Check availability <https://pricing.snapeda.com/parts/TESEO-LIV3F/STMicroelectronics/view-part?ref=eda>; AVAILABILITY: In Stock; CHECK_PRICES: https://www.snapeda.com/parts/TESEO-LIV3F/STMicroelectronics/view-part/?ref=eda; DESCRIPTION: - RF Receiver BeiDou, Galileo, GLONASS, GNSS, GPS 1.575GHz -163dBm Not Included 18-LCC (9.7x10.1); MF: STMicroelectronics; MP: TESEO-LIV3F; PACKAGE: SMD-18 STMicroelectronics; PRICE: None; PURCHASE-URL: https://www.snapeda.com/api/url_track_click_mouser/?unipart_id=1474256&manufacturer=STMicroelectronics&part_name=TESEO-LIV3F&search_term=None; SNAPEDA_LINK: https://www.snapeda.com/parts/TESEO-LIV3F/STMicroelectronics/view-part/?ref=snap
H2-H4 = holes:MOUNT-PAD-ROUND: MOUNTING PAD, round
IC1 = BMP280-standalone:BMP280: The BMP280 is an absolute barometric pressure sensor especially designed for mobile applications. The sensor module is housed in an extremely compact 8-pin metal-lid LGA package with a footprint of only 2.0 × 2.5 mm2 and 0.95 mm package height. Its small dimensions and its low power consumption of 2.7 μA @1Hz allow the implementation in battery driven devices such as mobile phones, GPS modules or watches. The library has been designed by Richard Magdycz <https://www.facebook.com/groups/eaglecadsoftUK>
IC2 = MPXV5100DP:MPXV5100DP: Board Mount Pressure Sensors SOP DUAL PORT Source: Datasheet <http://www.nxp.com/docs/en/data-sheet/MPX5100.pdf>; DESCRIPTION: Board Mount Pressure Sensors SOP DUAL PORT; HEIGHT: 9.906mm; MANUFACTURER_NAME: NXP; MANUFACTURER_PART_NUMBER: MPXV5100DP
IC3 = AS179-92LF:AS179-92LF: SKYWORKS SOLUTIONS - AS179-92LF - IC, SWITCH, RF, SPDT, 0.02-3.0GHZ Source: Datasheet <https://datasheet.datasheetarchive.com/originals/distributors/Datasheets-DGA1/141541.pdf>; DESCRIPTION: SKYWORKS SOLUTIONS - AS179-92LF - IC, SWITCH, RF, SPDT, 0.02-3.0GHZ; HEIGHT: 1mm; MANUFACTURER_NAME: Skyworks; MANUFACTURER_PART_NUMBER: AS179-92LF
IC6 = MAX8574EUT+T:MAX8574EUT+T: MAXIM INTEGRATED PRODUCTS - MAX8574EUT+T - DC/DC CONV, BOOST, 800KHZ, 85DEG C Source: Datasheet <https://datasheets.maximintegrated.com/en/ds/MAX8570-MAX8575.pdf>; DESCRIPTION: MAXIM INTEGRATED PRODUCTS - MAX8574EUT+T - DC/DC CONV, BOOST, 800KHZ, 85DEG C; HEIGHT: 1.45mm; MANUFACTURER_NAME: Analog Devices; MANUFACTURER_PART_NUMBER: MAX8574EUT+T
IC9 = MCP73843-420I_MS:MCP73843-420I_MS: Li-Ion Charge Controller 4.2V MSOP8 Source: Datasheet <http://ww1.microchip.com/downloads/en/DeviceDoc/21823D.pdf>; DESCRIPTION: Li-Ion Charge Controller 4.2V MSOP8; HEIGHT: 1.1mm; MANUFACTURER_NAME: Microchip; MANUFACTURER_PART_NUMBER: MCP73843-420I/MS
J1-J5 J9 J13 = 282834-2:282834-2: Check availability <https://pricing.snapeda.com/parts/282834-2/TE%20Connectivity/view-part?ref=eda>; AVAILABILITY: In Stock; CENTERLINE_PITCH: 2.54 mm[.1 in]; CHECK_PRICES: https://www.snapeda.com/parts/282834-2/TE+Connectivity+AMP+Connectors/view-part/?ref=eda; COMMENT: 282834-2; DESCRIPTION: Terminal Block Connector PCB 2.54 mm 30-16 AWG Green 10 A 150 V M1.6 | TE Connectivity 282834-2; EU_ROHS_COMPLIANCE: Compliant with Exemptions; MF: TE Connectivity; MP: 282834-2; NUMBER_OF_POSITIONS: 2; PACKAGE: None; PRICE: None; PURCHASE-URL: https://www.snapeda.com/api/url_track_click_mouser/?unipart_id=431057&manufacturer=TE Connectivity&part_name=282834-2&search_term=None; SNAPEDA_LINK: https://www.snapeda.com/parts/282834-2/TE+Connectivity+AMP+Connectors/view-part/?ref=snap
J6 = 503182-1852:503182-1852: Micro SD Normal UltraLowPro8CktEmbsTpPkg Source: Datasheet <https://www.molex.com/pdm_docs/sd/5031821852_sd.pdf>; DESCRIPTION: Micro SD Normal UltraLowPro8CktEmbsTpPkg; HEIGHT: mm; MANUFACTURER_NAME: Molex; MANUFACTURER_PART_NUMBER: 503182-1852
J7 = XT60-M:XT60-M: Check availability <https://pricing.snapeda.com/parts/XT60-M/AMASS/view-part?ref=eda>; AVAILABILITY: Not in stock; DESCRIPTION: Plug; DC supply; XT60; male; PIN: 2; for cable; soldered; 30A; 500V; MF: AMASS; MP: XT60-M; PACKAGE: Package; PRICE: None
J8 = SMA_CONNECTOR (1):SMA_CONNECTOR: Straight SMA Connector Check availability <https://pricing.snapeda.com/parts/SMA%20CONNECTOR/LPRS/view-part?ref=eda>; AVAILABILITY: In Stock; CHECK_PRICES: https://www.snapeda.com/parts/SMA%20CONNECTOR/LPRS/view-part/?ref=eda; DESCRIPTION: RF Coaxial Straight SMA Connector; MF: LPRS; MP: SMA CONNECTOR; PACKAGE: None; PRICE: None; SNAPEDA_LINK: https://www.snapeda.com/parts/SMA%20CONNECTOR/LPRS/view-part/?ref=snap
J10 J11 = B2B-XH-A_LF__SN_:B2B-XH-A(LF)(SN): Check availability <https://pricing.snapeda.com/parts/B2B-XH-A%28LF%29%28SN%29/JST%20Sales/view-part?ref=eda>; AVAILABILITY: In Stock; CHECK_PRICES: https://www.snapeda.com/parts/B2B-XH-A(LF)(SN)/JST+Sales+America+Inc./view-part/?ref=eda; DESCRIPTION: Connector Header Through Hole 2 position 0.098 (2.50mm); MF: JST Sales; MP: B2B-XH-A(LF)(SN); PACKAGE: None; PRICE: None; SNAPEDA_LINK: https://www.snapeda.com/parts/B2B-XH-A(LF)(SN)/JST+Sales+America+Inc./view-part/?ref=snap
L1 = SRR1260-330M:SRR1260-330M: Inductor Power Shielded Wirewound 33uH 20% 100KHz 27Q-Factor Ferrite 3A 60mOhm DCR T/R Check availability <https://pricing.snapeda.com/parts/SRR1260-330M/Bourns/view-part?ref=eda>; AVAILABILITY: In Stock; CHECK_PRICES: https://www.snapeda.com/parts/SRR1260-330M/Bourns/view-part/?ref=eda; DESCRIPTION: Inductor, Power, Shielded, Wirewound, 33uH, 20%, 3.0A | Bourns SRR1260-330M; MF: Bourns; MP: SRR1260-330M; PACKAGE: Nonstandard Bourns; PRICE: None; PURCHASE-URL: https://www.snapeda.com/api/url_track_click_mouser/?unipart_id=378985&manufacturer=Bourns&part_name=SRR1260-330M&search_term=None; SNAPEDA_LINK: https://www.snapeda.com/parts/SRR1260-330M/Bourns/view-part/?ref=snap
L6-L8 = standardparts:RF-INDUCTOR
LNA = BGA725L6E6327FTSA1:BGA725L6E6327FTSA1: IC AMP GPS 1.55-1.615GHZ TSLP6-2 Check availability <https://pricing.snapeda.com/parts/BGA725L6E6327FTSA1/Infineon%20Technologies/view-part?ref=eda>; AVAILABILITY: In Stock; CHECK_PRICES: https://www.snapeda.com/parts/BGA725L6E6327FTSA1/Infineon+Technologies/view-part/?ref=eda; DESCRIPTION: The BGA725L6 is a front-end low noise amplifier for Global Navigation Satellite Systems (GNSS) from 1550 MHz to 1615 MHz like GPS, GLONASS, Beidou, Galileo and others.; MF: Infineon Technologies; MP: BGA725L6E6327FTSA1; PACKAGE: XFDFN-6 Infineon Technologies; PRICE: None; PURCHASE-URL: https://www.snapeda.com/api/url_track_click_mouser/?unipart_id=426432&manufacturer=Infineon Technologies&part_name=BGA725L6E6327FTSA1&search_term=None; SNAPEDA_LINK: https://www.snapeda.com/parts/BGA725L6E6327FTSA1/Infineon+Technologies/view-part/?ref=snap
Q1 = SI7625DN-T1-GE3:SI7625DN-T1-GE3: VISHAY - SI7625DN-T1-GE3 - MOSFET, P CHANNEL, -30V, -35A, POWERPAK 1212-8 Source: Datasheet <https://www.vishay.com/docs/65737/si7625dn.pdf>; DESCRIPTION: VISHAY - SI7625DN-T1-GE3 - MOSFET, P CHANNEL, -30V, -35A, POWERPAK 1212-8; HEIGHT: 1.12mm; MANUFACTURER_NAME: Vishay; MANUFACTURER_PART_NUMBER: SI7625DN-T1-GE3
Q2-Q5 = microbuilder:MOSFET-P: P-Channel Mosfet LEGEND VDS: Voltage Drain-Source ID: Drain Current RDS(ON): Drain-Source On-State Resistance VGS(TH): Gate-Source Threshold Voltage CISS: Drain-Source Input Capacitance SOT-23 Name VDS ID RDS(ON) VGS(TH) CISS Order Number IRLML5103 30V 760mA 600 mOhm -- 75pF @ 25V Digikey: IRLML5103PBFCT-ND IRLML6401 12V 4.3A 50 mOhm 950mV @ 250µA 830pF @ 10V Digikey: IRLML6401PBFTR-ND NTR0202PL 20V 400mA 800 mOhm 2.3V @ 250uA 70pF @ 5V Digikey: NTR0202PLT1GOSTR-ND NTR4101PT1G 20V 1.8A 85 mOhm 1.2V @ 250uA 675pF @ 10V Digikey: NTR4101PT1GOSCT-ND DMP2004K 20V 600mA 900 mOhm 1V @ 250uA 175pF @ 16V Digikey: DMP2004KDICT-ND PMV65XP 20V 3.9A 76 mOhm 950mV @ 1mA 725pF @ 20V Digikey: 568-2358-2-ND TO-252 Name VDS ID RDS(ON) VGS(TH) CISS Order Number AOD417 30V 25A 34 mOhm 3V @ 250µA 920pF @ 15V Digikey: 785-1106-2-ND
R0 R1-R102 = standardparts:RESISTOR
RP2040 = RpiPico:RP2040-QFN56
SAW = AFS14A04-1575.42-T3:AFS14A04-1575.42-T3; MANUFACTURER: Abracon; MAXIMUM_PACKAGE_HEIGHT: 0.7mm; PARTREV: 04.16.13; SNAPEDA_PN: AFS14A04-1575.42-T3; STANDARD: Manufacturer Recommendations
U1 = BNO055:BNO055: BNO055 9-axis Absolute Orientation Sensor ( SiP ) w/Sensors and Sensor Fusion Check availability <https://pricing.snapeda.com/parts/BNO055/Bosch/view-part?ref=eda>; AVAILABILITY: In Stock; CHECK_PRICES: https://www.snapeda.com/parts/BNO055/Bosch+Sensortec/view-part/?ref=eda; DESCRIPTION: BNO055 series Accelerometer, Gyroscope, Magnetometer, 3 Axis Sensor Evaluation Board; MF: Bosch; MP: BNO055; PACKAGE: LGA-28 Bosch; PRICE: None; PURCHASE-URL: https://www.snapeda.com/api/url_track_click_mouser/?unipart_id=51961&manufacturer=Bosch&part_name=BNO055&search_term=None; SNAPEDA_LINK: https://www.snapeda.com/parts/BNO055/Bosch+Sensortec/view-part/?ref=snap
U2 U3 U5 U7 = BS170F:BS170F: DMOS FET Check availability <https://pricing.snapeda.com/parts/BS170F/Diodes%20Inc./view-part?ref=eda>; AVAILABILITY: In Stock; CHECK_PRICES: https://www.snapeda.com/parts/BS170F/Diodes+Inc./view-part/?ref=eda; DESCRIPTION: N-Channel 60 V 150µA (Ta) 330mW (Ta) Surface Mount SOT-23-3; MF: Diodes Inc.; MP: BS170F; PACKAGE: SOT-23 Multicomp; PRICE: None; SNAPEDA_LINK: https://www.snapeda.com/parts/BS170F/Diodes+Inc./view-part/?ref=snap
U4 U10 = LM1117-3.3:LM1117-3.3: IC REG LDO 800MA 3.3V Check availability <https://pricing.snapeda.com/parts/LM1117-3.3/Texas%20Instruments/view-part?ref=eda>; AVAILABILITY: In Stock; CHECK_PRICES: https://www.snapeda.com/parts/LM1117-3.3/Texas+Instruments/view-part/?ref=eda; DESCRIPTION: Linear Voltage Regulator IC Positive Fixed 1 Output 800mA DDPAK/TO-263-3; MF: Texas Instruments; MP: LM1117-3.3; PACKAGE: None; PRICE: None; SNAPEDA_LINK: https://www.snapeda.com/parts/LM1117-3.3/Texas+Instruments/view-part/?ref=snap
U6 U9 U15 U16 = ADS1115IDGSR:ADS1115IDGSR: Check availability <https://pricing.snapeda.com/parts/ADS1115IDGSR/Texas%20Instruments/view-part?ref=eda>; AVAILABILITY: In Stock; CHECK_PRICES: https://www.snapeda.com/parts/ADS1115IDGSR/Texas+Instruments/view-part/?ref=eda; DESCRIPTION: 16-bit, 860-SPS, 4-channel, delta-sigma ADC with PGA, oscillator, VREF, comparator and I2C; MF: Texas Instruments; MP: ADS1115IDGSR; PACKAGE: VSSOP-10 Texas Instruments; PRICE: None; PURCHASE-URL: https://www.snapeda.com/api/url_track_click_mouser/?unipart_id=45903&manufacturer=Texas Instruments&part_name=ADS1115IDGSR&search_term=ads1115; SNAPEDA_LINK: https://www.snapeda.com/parts/ADS1115IDGSR/Texas+Instruments/view-part/?ref=snap
U8 U11-U14 = MIC29302WU:MIC29302WU-TR; COPYRIGHT: Copyright (C) 2024 Ultra Librarian. All rights reserved.; MANUFACTURER_PART_NUMBER: MIC29302WU-TR; MFR_NAME: Microchip
U17 = CP2102:CP2102: USB to UART Bridge Check availability <https://pricing.snapeda.com/parts/CP2102/Silicon%20Labs/view-part?ref=eda>; AVAILABILITY: In Stock; CHECK_PRICES: https://www.snapeda.com/parts/CP2102/Silicon+Labs/view-part/?ref=eda; DESCRIPTION: CP2102N USB 2.0 to UART (RS232) Bridge Interface Evaluation Board; MF: Silicon Labs; MP: CP2102; PACKAGE: QFN-28 Silicon Labs; PRICE: None; PURCHASE-URL: https://www.snapeda.com/api/url_track_click_mouser/?unipart_id=228557&manufacturer=Silicon Labs&part_name=CP2102&search_term=None; SNAPEDA_LINK: https://www.snapeda.com/parts/CP2102/Silicon+Labs/view-part/?ref=snap
U$1 U$3 = SN74LVC1G04DBVR:SN74LVC1G04DBVR: Check availability <https://pricing.snapeda.com/parts/SN74LVC1G04DBVR/UMW/view-part?ref=eda>; AVAILABILITY: In Stock; CHECK_PRICES: https://www.snapeda.com/parts/SN74LVC1G04DBVR/Umwelt+Sensor+Teknik/view-part/?ref=eda; DESCRIPTION: Inverter IC 1 Channel SOT-23-5; MF: UMW; MP: SN74LVC1G04DBVR; PACKAGE: None; PRICE: None; SNAPEDA_LINK: https://www.snapeda.com/parts/SN74LVC1G04DBVR/Umwelt+Sensor+Teknik/view-part/?ref=snap
VR1 = XL6009:XL6009: The XL6009 regulator is a wide input range, current mode, DC/DC converter which is capable of generating either positive or negative output voltages. Check availability <https://pricing.snapeda.com/parts/XL6009/XLSEMI/view-part?ref=eda>; AVAILABILITY: In Stock; CHECK_PRICES: https://www.snapeda.com/parts/XL6009/XLSEMI/view-part/?ref=eda; DESCRIPTION: The XL6009 regulator is a wide input range, current mode, DC/DC converter which is capable of generating either positive or negative output voltages.; MF: XLSEMI; MP: XL6009; PACKAGE: TO-263-5L XLSEMI; PRICE: None; SNAPEDA_LINK: https://www.snapeda.com/parts/XL6009/XLSEMI/view-part/?ref=snap
X6 = microbuilder:USB_C: USB Type-C USB 2.0 Connector
XBEE = XBP9B-XCST-021:XBP9B-XCST-021: XBee-PRO 900HP DigiMesh 900 MHz 200 Kbps RF Module with U.FL Connector Check availability <https://pricing.snapeda.com/parts/XBP9B-XCST-021/Digi%20International/view-part?ref=eda>; AVAILABILITY: In Stock; CHECK_PRICES: https://www.snapeda.com/parts/XBP9B-XCST-021/Digi+International/view-part/?ref=eda; DESCRIPTION: General ISM < 1GHz - Transceiver Module 920MHz Antenna Not Included, RP-SMA Through Hole; MF: Digi International; MP: XBP9B-XCST-021; PACKAGE: Module Digi International; PRICE: None; PURCHASE-URL: https://www.snapeda.com/api/url_track_click_mouser/?unipart_id=521579&manufacturer=Digi International&part_name=XBP9B-XCST-021&search_term=None; SNAPEDA_LINK: https://www.snapeda.com/parts/XBP9B-XCST-021/Digi+International/view-part/?ref=snap
XTAL = crystal:ASE: 3.3Vdc CMOS SMD CRYSTAL CLOCK OSCILLATOR SOurce: www.abracon.com; OC_FARNELL: unknown; OC_NEWARK: unknown
Y1 = FC-135_32.7680KA-A0:FC-135_32.7680KA-A0: None Check availability <https://pricing.snapeda.com/parts/FC-135%2032.7680KA-A0/EPSON/view-part?ref=eda>; AVAILABILITY: In Stock; CHECK_PRICES: https://www.snapeda.com/parts/FC-135%2032.7680KA-A0/EPSON/view-part/?ref=eda; DESCRIPTION: 32.768 kHz ±20ppm Crystal 12.5pF 70 kOhms 2-SMD, No Lead; MF: EPSON; MP: FC-135 32.7680KA-A0; PACKAGE: SMD-2 Epson; PRICE: None; SNAPEDA_LINK: https://www.snapeda.com/parts/FC-135%2032.7680KA-A0/EPSON/view-part/?ref=snap

## Net classes
1 power: width 0.305 mm